# Altium project mecobo3.PrjPcb (part 1 of 2)
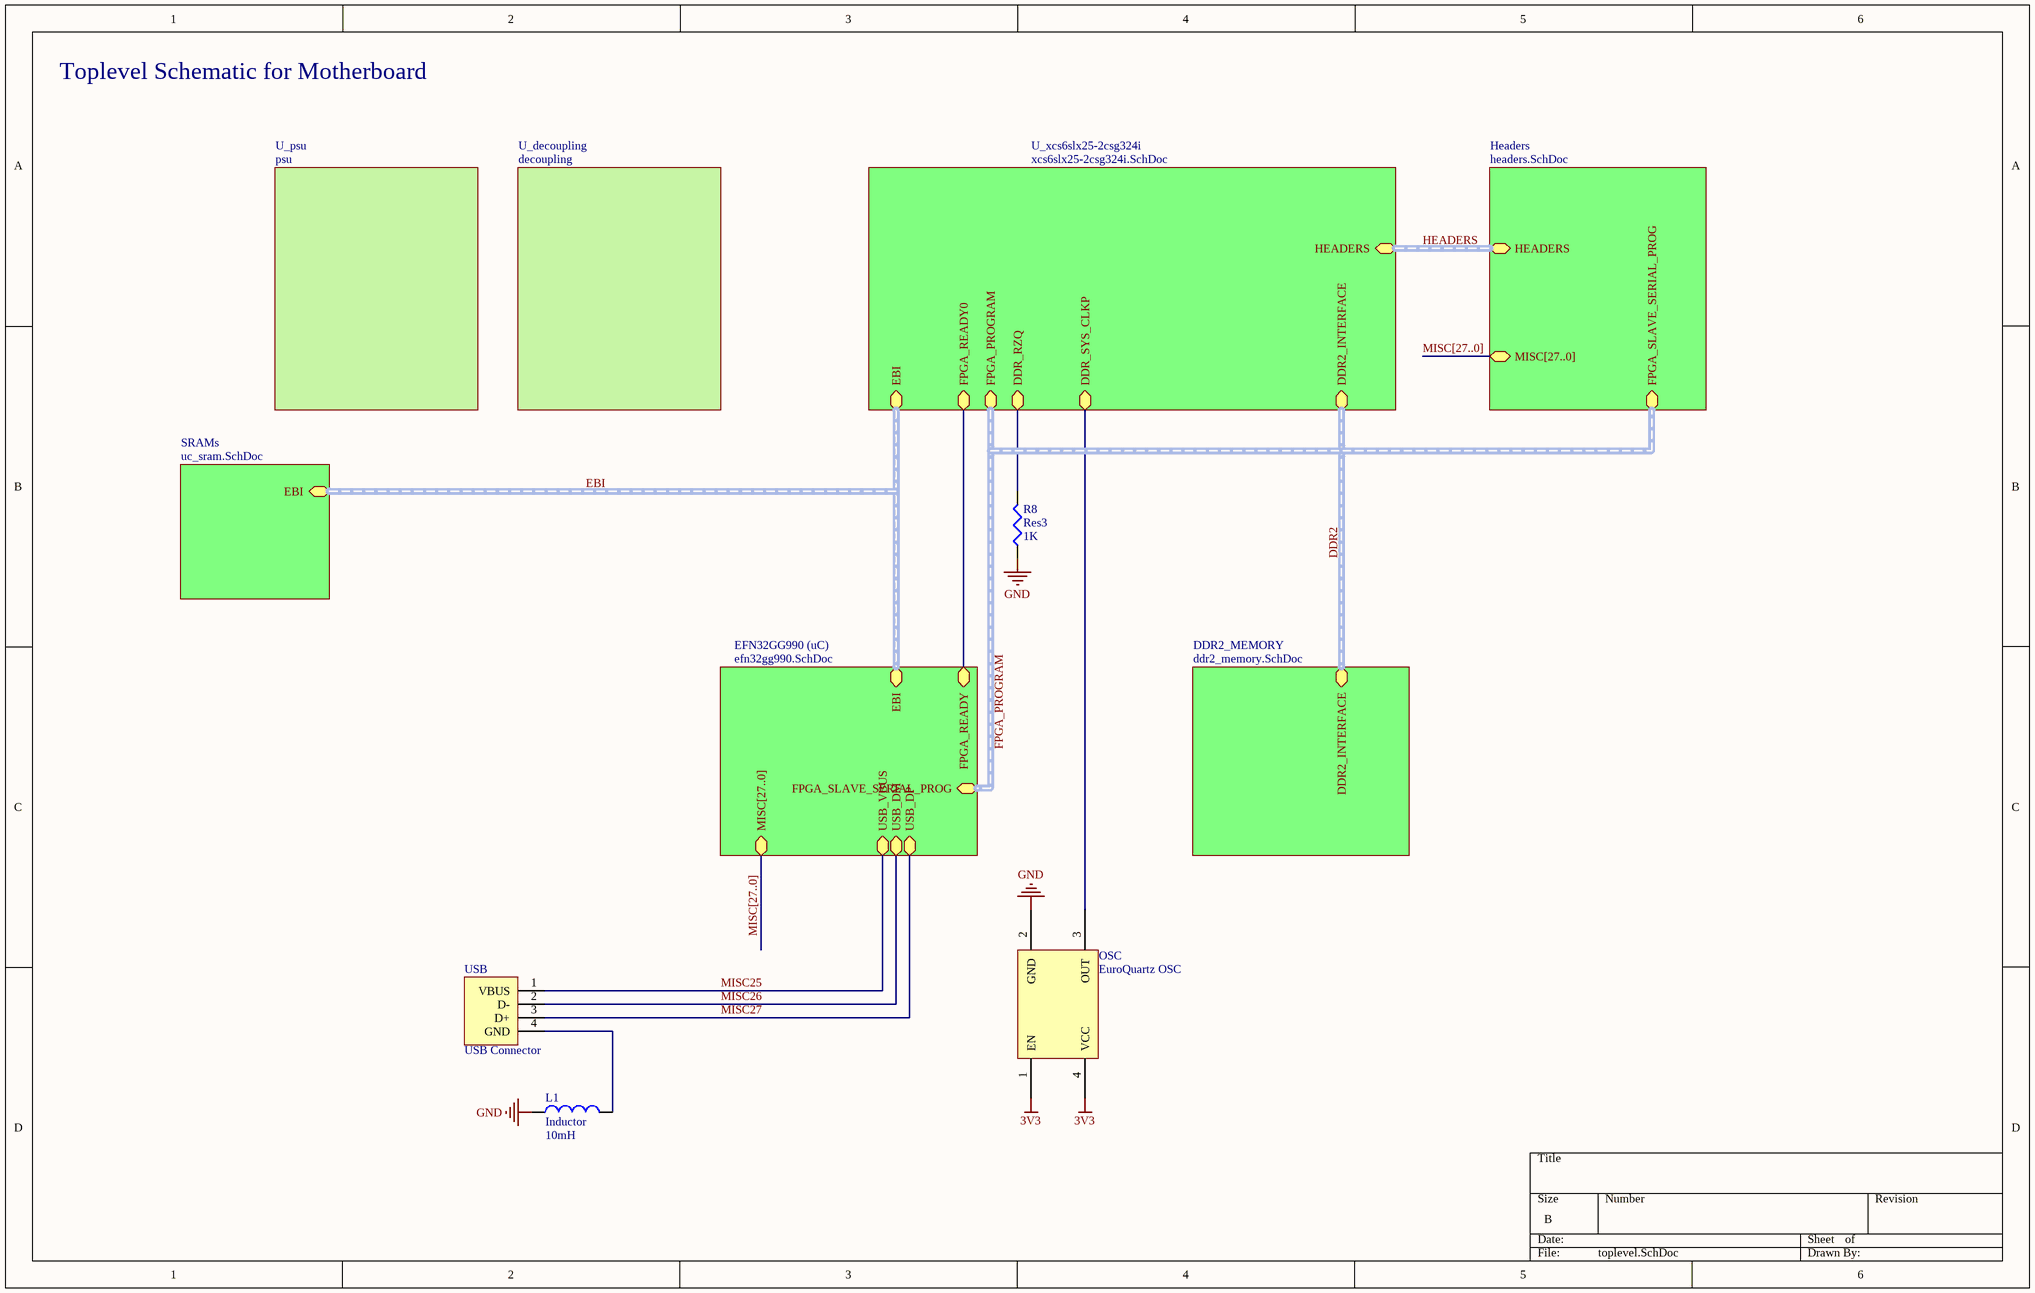
[diagram p0: toplevel.SchDoc]
10 sheets, 112 parts. Net scope: hierarchical (ports join the sheet entries above them; power ports are global).
Board file: board_2.PcbDoc
Sheets:
  toplevel.SchDoc
    EFN32GG990 (uC) = efn32gg990.SchDoc
    U_xcs6slx25-2csg324i = xcs6slx25-2csg324i.SchDoc
    U_psu = psu.SchDoc
      MAX8860EUA18 = 8860.SchDoc
      MAX8860EUA33 = 8860.SchDoc
      U_MIC5248 = MIC5248.SchDoc
    U_decoupling = decoupling.SchDoc
    DDR2_MEMORY = ddr2_memory.SchDoc
    Headers = headers.SchDoc
    SRAMs = uc_sram.SchDoc

## Sheet toplevel.SchDoc: Toplevel Schematic for Motherboard
size B

### Parts
L1  Inductor  value 10mH  [C1210]
OSC  EuroQuartz OSC  [SOP4]
R8  Res3  value 1K  [14-1210]
USB  USB Connector  [USB2.5-2H4D]

### Sub-sheets
DDR2_MEMORY = ddr2_memory.SchDoc: DDR2_INTERFACE (harness DDR2_INTERFACE)
EFN32GG990 (uC) = efn32gg990.SchDoc: USB_VBUS, USB_DP, USB_DM, FPGA_READY, FPGA_SLAVE_SERIAL_PROG (harness FPGA_SLAVE_SERIAL_PROG), EBI (harness EBI), MISC[27..0]
Headers = headers.SchDoc: HEADERS (harness HEADERS), MISC[27..0], FPGA_SLAVE_SERIAL_PROG (harness FPGA_SLAVE_SERIAL_PROG)
SRAMs = uc_sram.SchDoc: EBI (harness EBI)
U_decoupling = decoupling: no entries
U_psu = psu: no entries
U_xcs6slx25-2csg324i = xcs6slx25-2csg324i.SchDoc: FPGA_READY0, DDR_RZQ, DDR_SYS_CLKP, DDR2_INTERFACE (harness DDR2_INTERFACE), FPGA_PROGRAM (harness FPGA_SLAVE_SERIAL_PROG), EBI (harness EBI), HEADERS (harness HEADERS)

### Nets
3V3: OSC.1(EN) OSC.4(VCC)
GND: L1.1 OSC.2(GND) R8.1
DDR_RZQ: R8.2 ; sheet U_xcs6slx25-2csg324i/DDR_RZQ
FPGA_READY: sheet EFN32GG990 (uC)/FPGA_READY, sheet U_xcs6slx25-2csg324i/FPGA_READY0
MISC25: USB.1(VBUS) ; sheet EFN32GG990 (uC)/USB_VBUS
MISC26: USB.2(D-) ; sheet EFN32GG990 (uC)/USB_DM
MISC27: USB.3(D+) ; sheet EFN32GG990 (uC)/USB_DP
NetFPGA_R10: OSC.3(OUT) ; sheet U_xcs6slx25-2csg324i/DDR_SYS_CLKP
NetL1_2: L1.2 USB.4(GND)

### Buses and harness runs
bus MISC[27..0] = sheet EFN32GG990 (uC)/MISC[27..0]
bus MISC[27..0] = sheet Headers/MISC[27..0]
harness DDR2 = sheet DDR2_MEMORY/DDR2_INTERFACE = sheet U_xcs6slx25-2csg324i/DDR2_INTERFACE
harness EBI = sheet EFN32GG990 (uC)/EBI = sheet SRAMs/EBI = sheet U_xcs6slx25-2csg324i/EBI
harness FPGA_PROGRAM = sheet EFN32GG990 (uC)/FPGA_SLAVE_SERIAL_PROG = sheet Headers/FPGA_SLAVE_SERIAL_PROG = sheet U_xcs6slx25-2csg324i/FPGA_PROGRAM
harness HEADERS = sheet Headers/HEADERS = sheet U_xcs6slx25-2csg324i/HEADERS

### Notes on the sheet
- Toplevel Schematic for Motherboard

### Library data of the parts
L1 = Inductor: Code_IEC: 1005; Published: 8-Jun-2000; LatestRevisionDate: 29-May-2009; LatestRevisionNote: IPC-7351 Footprint Added.; PackageReference: 0402-A; Publisher: Altium Limited; PackageDescription: Chip Inductor; Code_JEITA: 0402
OSC = EuroQuartz OSC: XO53050UITA
R8 = Res3: Resistor; Published: 8-Jun-2000; LatestRevisionDate: 29-May-2009; LatestRevisionNote: IPC-7351 Footprint Added.; PackageReference: J1-0603; Publisher: Altium Limited; PackageDescription: Chip Resistor

## Sheet efn32gg990.SchDoc
size C
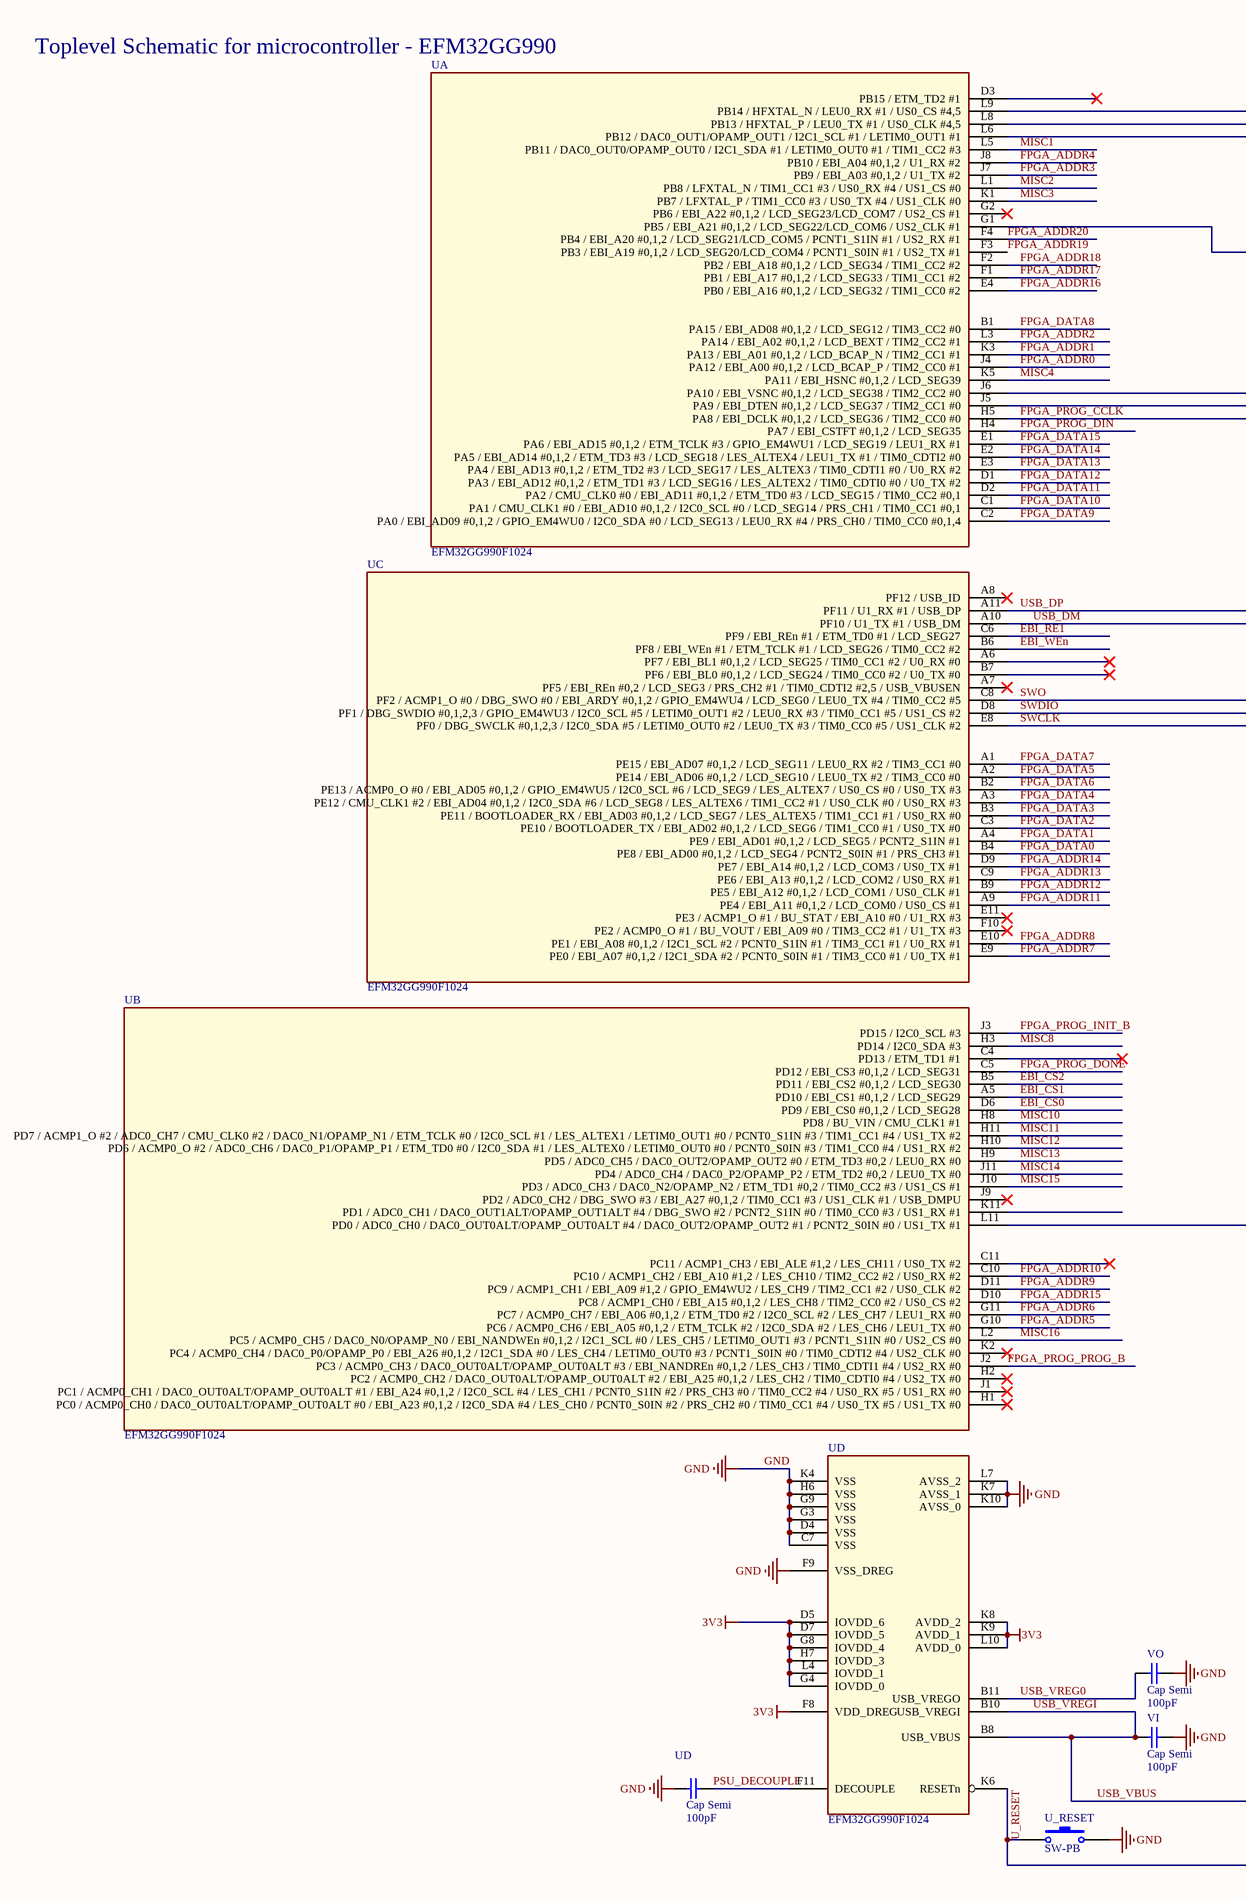
[diagram p1: efn32gg990.SchDoc, left]
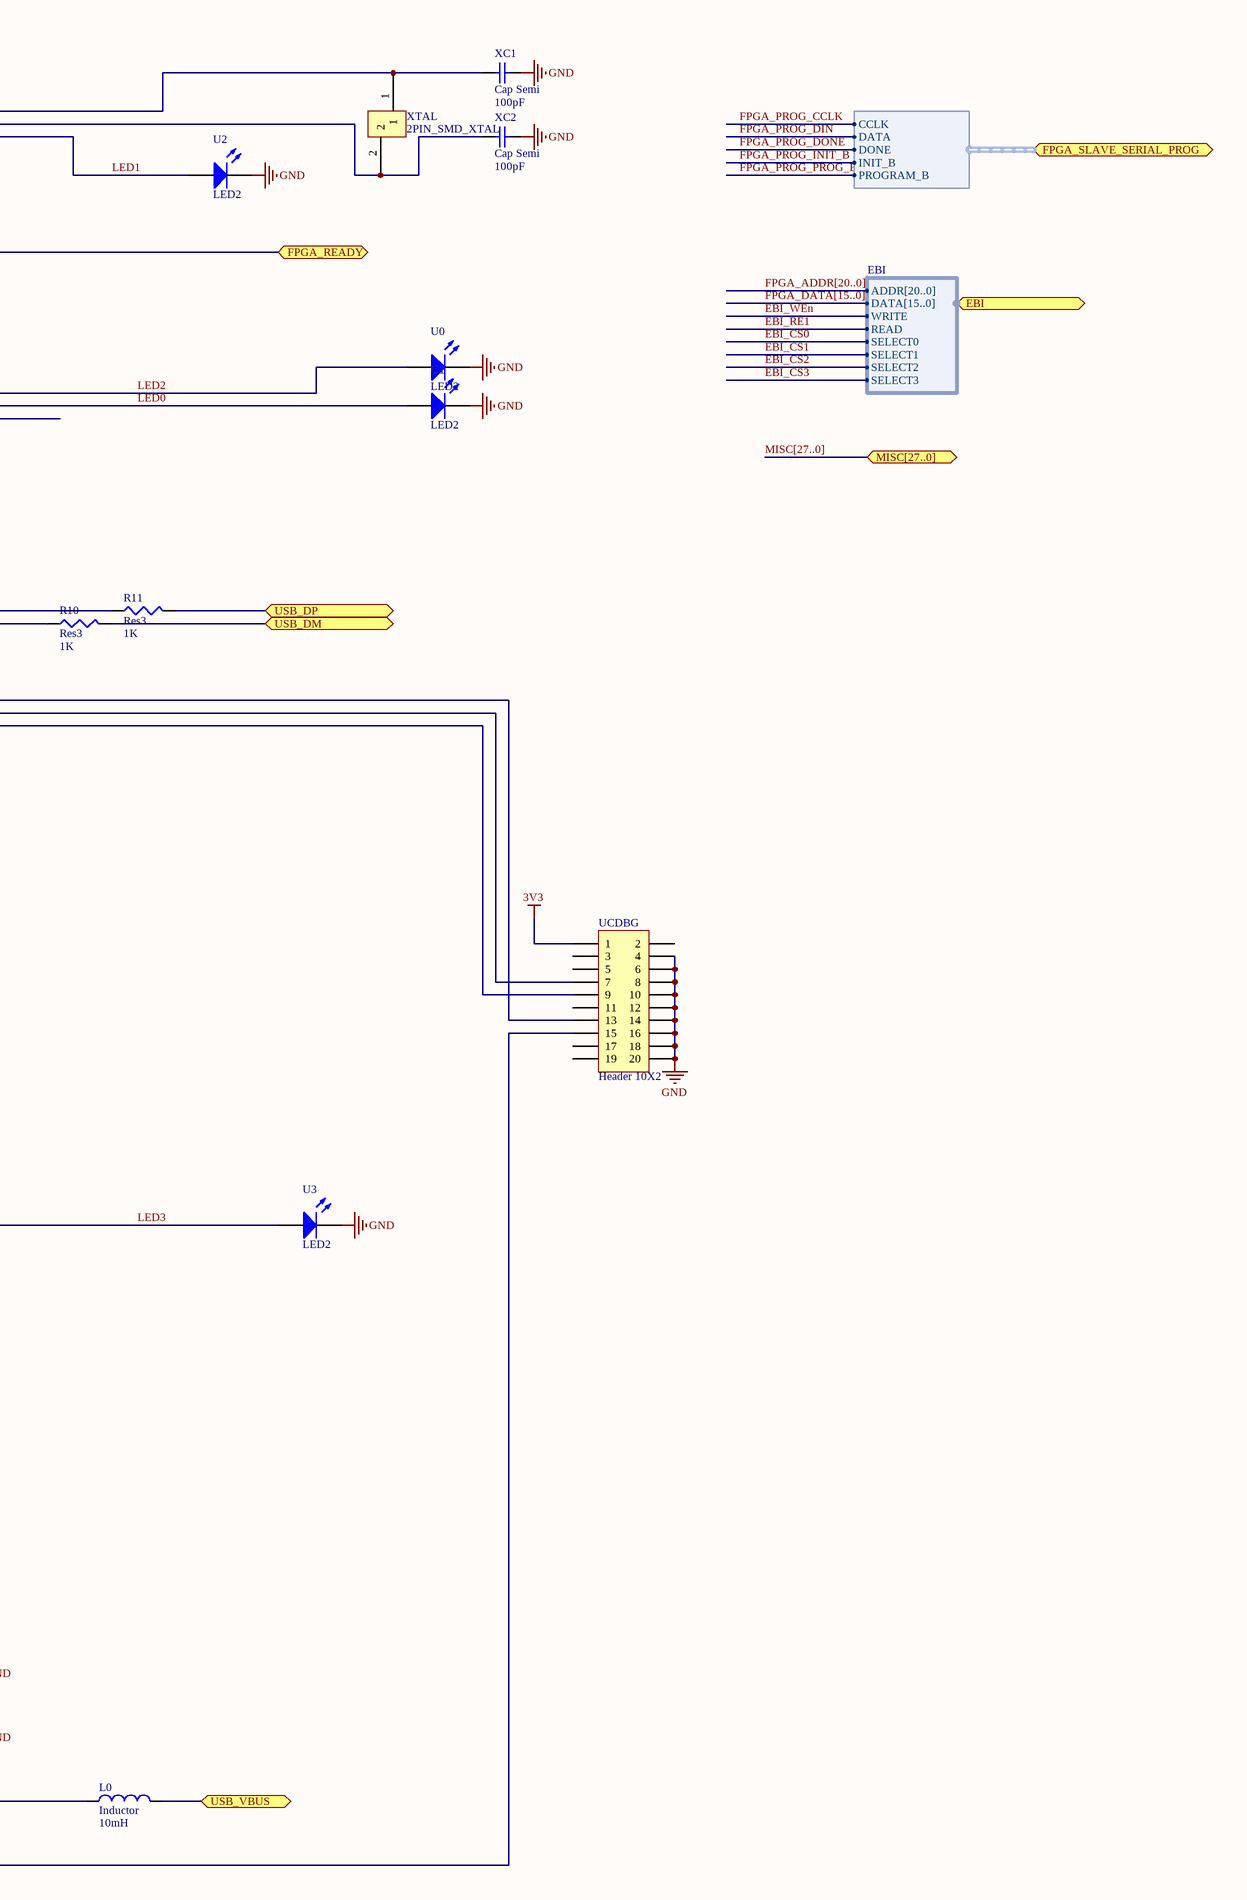
[diagram p2: efn32gg990.SchDoc, right]

### Parts
L0  Inductor  value 10mH  [C1210]
R10  Res3  value 1K  [14-1210]
R11  Res3  value 1K  [14-1210]
U  EFM32GG990F1024  [BGA112]  (parts A,B,C,D of 4)
U0  LED2  [3.2X1.6X1.1]
U1  LED2  [3.2X1.6X1.1]
U2  LED2  [3.2X1.6X1.1]
U3  LED2  [3.2X1.6X1.1]
U_RESET  SW-PB  [SPST-2]
UCDBG  Header 10X2  [HDR2X10]
UD  Cap Semi  value 100pF  [C1206]
VI  Cap Semi  value 100pF  [C1206]
VO  Cap Semi  value 100pF  [C1206]
XC1  Cap Semi  value 100pF  [C1206]
XC2  Cap Semi  value 100pF  [C1206]
XTAL  2PIN_SMD_XTAL  [48MHZ_XTAL_PAD]

### Ports
EBI (harness EBI), FPGA_READY, FPGA_SLAVE_SERIAL_PROG (harness FPGA_SLAVE_SERIAL_PROG), MISC[27..0], USB_DM, USB_DP, USB_VBUS

### Harnesses
FPGA_SLAVE_SERIAL_PROG: CCLK, DATA, DONE, INIT_B, PROGRAM_B
EBI: READ, WRITE, SELECT0, DATA[15..0], ADDR[20..0], SELECT1, SELECT2, SELECT3

### Nets
3V3: U.D5(IOVDD_6) U.D7(IOVDD_5) U.F8(VDD_DREG) U.G4(IOVDD_0) U.G8(IOVDD_4) U.H7(IOVDD_3) U.K8(AVDD_2) U.K9(AVDD_1) U.L4(IOVDD_1) U.L10(AVDD_0) UCDBG.1
GND: U.C7(VSS) U.D4(VSS) U.F9(VSS_DREG) U.G3(VSS) U.G9(VSS) U.H6(VSS) U.K4(VSS) U.K7(AVSS_1) U.K10(AVSS_0) U.L7(AVSS_2) U0.2(K) U1.2(K) U2.2(K) U3.2(K) U_RESET.2 UCDBG.4 UCDBG.6 UCDBG.8 UCDBG.10 UCDBG.12 UCDBG.14 UCDBG.16 UCDBG.18 UCDBG.20 UD.1 VI.2 VO.2 XC1.2 XC2.2
EBI_CS0: U.D6(PD9_/_EBI_CS0_#0,1,2_/_LCD_SEG28) ; port EBI.SELECT0  [project net EBI.SELECT0]
EBI_CS1: U.A5(PD10_/_EBI_CS1_#0,1,2_/_LCD_SEG29) ; port EBI.SELECT1  [project net EBI.SELECT1]
EBI_CS2: U.B5(PD11_/_EBI_CS2_#0,1,2_/_LCD_SEG30) ; port EBI.SELECT2  [project net EBI.SELECT2]
EBI_CS3: port EBI.SELECT3  [project net EBI.SELECT3]
EBI_RE1: U.C6(PF9_/_EBI_REn_#1_/_ETM_TD0_#1_/_LCD_SEG27) ; port EBI.READ  [project net EBI.READ]
EBI_WEn: U.B6(PF8_/_EBI_WEn_#1_/_ETM_TCLK_#1_/_LCD_SEG26_/_TIM0_CC2_#2) ; port EBI.WRITE  [project net EBI.WRITE]
FPGA_ADDR0: U.J4(PA12_/_EBI_A00_#0,1,2_/_LCD_BCAP_P_/_TIM2_CC0_#1)  [project net ADDR0]
FPGA_ADDR1: U.K3(PA13_/_EBI_A01_#0,1,2_/_LCD_BCAP_N_/_TIM2_CC1_#1)  [project net ADDR1]
FPGA_ADDR2: U.L3(PA14_/_EBI_A02_#0,1,2_/_LCD_BEXT_/_TIM2_CC2_#1)  [project net ADDR2]
FPGA_ADDR3: U.J7(PB9_/_EBI_A03_#0,1,2_/_U1_TX_#2)  [project net ADDR3]
FPGA_ADDR4: U.J8(PB10_/_EBI_A04_#0,1,2_/_U1_RX_#2)  [project net ADDR4]
FPGA_ADDR5: U.G10(PC6_/_ACMP0_CH6_/_EBI_A05_#0,1,2_/_ETM_TCLK_#2_/_I2C0_SDA_#2_/_LES_CH6_/_LEU1_TX_#0)  [project net ADDR5]
FPGA_ADDR6: U.G11(PC7_/_ACMP0_CH7_/_EBI_A06_#0,1,2_/_ETM_TD0_#2_/_I2C0_SCL_#2_/_LES_CH7_/_LEU1_RX_#0)  [project net ADDR6]
FPGA_ADDR7: U.E9(PE0_/_EBI_A07_#0,1,2_/_I2C1_SDA_#2_/_PCNT0_S0IN_#1_/_TIM3_CC0_#1_/_U0_TX_#1)  [project net ADDR7]
FPGA_ADDR8: U.E10(PE1_/_EBI_A08_#0,1,2_/_I2C1_SCL_#2_/_PCNT0_S1IN_#1_/_TIM3_CC1_#1_/_U0_RX_#1)  [project net ADDR8]
FPGA_ADDR9: U.D11(PC9_/_ACMP1_CH1_/_EBI_A09_#1,2_/_GPIO_EM4WU2_/_LES_CH9_/_TIM2_CC1_#2_/_US0_CLK_#2)  [project net ADDR9]
FPGA_ADDR10: U.C10(PC10_/_ACMP1_CH2_/_EBI_A10_#1,2_/_LES_CH10_/_TIM2_CC2_#2_/_US0_RX_#2)  [project net ADDR10]
FPGA_ADDR11: U.A9(PE4_/_EBI_A11_#0,1,2_/_LCD_COM0_/_US0_CS_#1)  [project net ADDR11]
FPGA_ADDR12: U.B9(PE5_/_EBI_A12_#0,1,2_/_LCD_COM1_/_US0_CLK_#1)  [project net ADDR12]
FPGA_ADDR13: U.C9(PE6_/_EBI_A13_#0,1,2_/_LCD_COM2_/_US0_RX_#1)  [project net ADDR13]
FPGA_ADDR14: U.D9(PE7_/_EBI_A14_#0,1,2_/_LCD_COM3_/_US0_TX_#1)  [project net ADDR14]
FPGA_ADDR15: U.D10(PC8_/_ACMP1_CH0_/_EBI_A15_#0,1,2_/_LES_CH8_/_TIM2_CC0_#2_/_US0_CS_#2)  [project net ADDR15]
FPGA_ADDR16: U.E4(PB0_/_EBI_A16_#0,1,2_/_LCD_SEG32_/_TIM1_CC0_#2)  [project net ADDR16]
FPGA_ADDR17: U.F1(PB1_/_EBI_A17_#0,1,2_/_LCD_SEG33_/_TIM1_CC1_#2)  [project net ADDR17]
FPGA_ADDR18: U.F2(PB2_/_EBI_A18_#0,1,2_/_LCD_SEG34_/_TIM1_CC2_#2)  [project net ADDR18]
FPGA_ADDR19: U.F3(PB3_/_EBI_A19_#0,1,2_/_LCD_SEG20/LCD_COM4_/_PCNT1_S0IN_#1_/_US2_TX_#1)  [project net ADDR19]
FPGA_ADDR20: U.F4(PB4_/_EBI_A20_#0,1,2_/_LCD_SEG21/LCD_COM5_/_PCNT1_S1IN_#1_/_US2_RX_#1)  [project net ADDR20]
FPGA_DATA0: U.B4(PE8_/_EBI_AD00_#0,1,2_/_LCD_SEG4_/_PCNT2_S0IN_#1_/_PRS_CH3_#1)  [project net DATA0]
FPGA_DATA1: U.A4(PE9_/_EBI_AD01_#0,1,2_/_LCD_SEG5_/_PCNT2_S1IN_#1)  [project net DATA1]
FPGA_DATA2: U.C3(PE10_/_BOOTLOADER_TX_/_EBI_AD02_#0,1,2_/_LCD_SEG6_/_TIM1_CC0_#1_/_US0_TX_#0)  [project net DATA2]
FPGA_DATA3: U.B3(PE11_/_BOOTLOADER_RX_/_EBI_AD03_#0,1,2_/_LCD_SEG7_/_LES_ALTEX5_/_TIM1_CC1_#1_/_US0_RX_#0)  [project net DATA3]
FPGA_DATA4: U.A3(PE12_/_CMU_CLK1_#2_/_EBI_AD04_#0,1,2_/_I2C0_SDA_#6_/_LCD_SEG8_/_LES_ALTEX6_/_TIM1_CC2_#1_/_US0_CLK_#0_/_US0_RX_#3)  [project net DATA4]
FPGA_DATA5: U.A2(PE14_/_EBI_AD06_#0,1,2_/_LCD_SEG10_/_LEU0_TX_#2_/_TIM3_CC0_#0)  [project net DATA5]
FPGA_DATA6: U.B2(PE13_/_ACMP0_O_#0_/_EBI_AD05_#0,1,2_/_GPIO_EM4WU5_/_I2C0_SCL_#6_/_LCD_SEG9_/_LES_ALTEX7_/_US0_CS_#0_/_US0_TX_#3)  [project net DATA6]
FPGA_DATA7: U.A1(PE15_/_EBI_AD07_#0,1,2_/_LCD_SEG11_/_LEU0_RX_#2_/_TIM3_CC1_#0)  [project net DATA7]
FPGA_DATA8: U.B1(PA15_/_EBI_AD08_#0,1,2_/_LCD_SEG12_/_TIM3_CC2_#0)  [project net DATA8]
FPGA_DATA9: U.C2(PA0_/_EBI_AD09_#0,1,2_/_GPIO_EM4WU0_/_I2C0_SDA_#0_/_LCD_SEG13_/_LEU0_RX_#4_/_PRS_CH0_/_TIM0_CC0_#0,1,4)  [project net DATA9]
FPGA_DATA10: U.C1(PA1_/_CMU_CLK1_#0_/_EBI_AD10_#0,1,2_/_I2C0_SCL_#0_/_LCD_SEG14_/_PRS_CH1_/_TIM0_CC1_#0,1)  [project net DATA10]
FPGA_DATA11: U.D2(PA2_/_CMU_CLK0_#0_/_EBI_AD11_#0,1,2_/_ETM_TD0_#3_/_LCD_SEG15_/_TIM0_CC2_#0,1)  [project net DATA11]
FPGA_DATA12: U.D1(PA3_/_EBI_AD12_#0,1,2_/_ETM_TD1_#3_/_LCD_SEG16_/_LES_ALTEX2_/_TIM0_CDTI0_#0_/_U0_TX_#2)  [project net DATA12]
FPGA_DATA13: U.E3(PA4_/_EBI_AD13_#0,1,2_/_ETM_TD2_#3_/_LCD_SEG17_/_LES_ALTEX3_/_TIM0_CDTI1_#0_/_U0_RX_#2)  [project net DATA13]
FPGA_DATA14: U.E2(PA5_/_EBI_AD14_#0,1,2_/_ETM_TD3_#3_/_LCD_SEG18_/_LES_ALTEX4_/_LEU1_TX_#1_/_TIM0_CDTI2_#0)  [project net DATA14]
FPGA_DATA15: U.E1(PA6_/_EBI_AD15_#0,1,2_/_ETM_TCLK_#3_/_GPIO_EM4WU1_/_LCD_SEG19_/_LEU1_RX_#1)  [project net DATA15]
FPGA_PROG_CCLK: U.H5(PA8_/_EBI_DCLK_#0,1,2_/_LCD_SEG36_/_TIM2_CC0_#0) ; port FPGA_SLAVE_SERIAL_PROG.CCLK  [project net FPGA_CCLK]
FPGA_PROG_DIN: U.H4(PA7_/_EBI_CSTFT_#0,1,2_/_LCD_SEG35) ; port FPGA_SLAVE_SERIAL_PROG.DATA  [project net FPGA_DIN]
FPGA_PROG_DONE: U.C5(PD12_/_EBI_CS3_#0,1,2_/_LCD_SEG31) ; port FPGA_SLAVE_SERIAL_PROG.DONE  [project net FPGA_DONE]
FPGA_PROG_INIT_B: U.J3(PD15_/_I2C0_SCL_#3) ; port FPGA_SLAVE_SERIAL_PROG.INIT_B  [project net FPGA_INIT_B]
FPGA_PROG_PROG_B: U.J2(PC3_/_ACMP0_CH3_/_DAC0_OUT0ALT/OPAMP_OUT0ALT_#3_/_EBI_NANDREn_#0,1,2_/_LES_CH3_/_TIM0_CDTI1_#4_/_US2_RX_#0) ; port FPGA_SLAVE_SERIAL_PROG.PROGRAM_B  [project net FPGA_PROG_B]
FPGA_READY: U.G1(PB5_/_EBI_A21_#0,1,2_/_LCD_SEG22/LCD_COM6_/_US2_CLK_#1) ; port FPGA_READY
LED0: U.J5(PA9_/_EBI_DTEN_#0,1,2_/_LCD_SEG37_/_TIM2_CC1_#0) U1.1(A)
LED1: U.L6(PB12_/_DAC0_OUT1/OPAMP_OUT1_/_I2C1_SCL_#1_/_LETIM0_OUT1_#1) U2.1(A)
LED2: U.J6(PA10_/_EBI_VSNC_#0,1,2_/_LCD_SEG38_/_TIM2_CC2_#0) U0.1(A)
LED3: U.L11(PD0_/_ADC0_CH0_/_DAC0_OUT0ALT/OPAMP_OUT0ALT_#4_/_DAC0_OUT2/OPAMP_OUT2_#1_/_PCNT2_S0IN_#0_/_US1_TX_#1) U3.1(A)
MISC1: U.L5(PB11_/_DAC0_OUT0/OPAMP_OUT0_/_I2C1_SDA_#1_/_LETIM0_OUT0_#1_/_TIM1_CC2_#3)
MISC2: U.L1(PB8_/_LFXTAL_N_/_TIM1_CC1_#3_/_US0_RX_#4_/_US1_CS_#0)
MISC3: U.K1(PB7_/_LFXTAL_P_/_TIM1_CC0_#3_/_US0_TX_#4_/_US1_CLK_#0)
MISC4: U.K5(PA11_/_EBI_HSNC_#0,1,2_/_LCD_SEG39)
MISC8: U.H3(PD14_/_I2C0_SDA_#3)
MISC10: U.H8(PD8_/_BU_VIN_/_CMU_CLK1_#1)
MISC11: U.H11(PD7_/_ACMP1_O_#2_/_ADC0_CH7_/_CMU_CLK0_#2_/_DAC0_N1/OPAMP_N1_/_ETM_TCLK_#0_/_I2C0_SCL_#1_/_LES_ALTEX1_/_LETIM0_OUT1_#0_/_PCNT0_S1IN_#3_/_TIM1_CC1_#4_/_US1_TX_#2)
MISC12: U.H10(PD6_/_ACMP0_O_#2_/_ADC0_CH6_/_DAC0_P1/OPAMP_P1_/_ETM_TD0_#0_/_I2C0_SDA_#1_/_LES_ALTEX0_/_LETIM0_OUT0_#0_/_PCNT0_S0IN_#3_/_TIM1_CC0_#4_/_US1_RX_#2)
MISC13: U.H9(PD5_/_ADC0_CH5_/_DAC0_OUT2/OPAMP_OUT2_#0_/_ETM_TD3_#0,2_/_LEU0_RX_#0)
MISC14: U.J11(PD4_/_ADC0_CH4_/_DAC0_P2/OPAMP_P2_/_ETM_TD2_#0,2_/_LEU0_TX_#0)
MISC15: U.J10(PD3_/_ADC0_CH3_/_DAC0_N2/OPAMP_N2_/_ETM_TD1_#0,2_/_TIM0_CC2_#3_/_US1_CS_#1)
MISC16: U.L2(PC5_/_ACMP0_CH5_/_DAC0_N0/OPAMP_N0_/_EBI_NANDWEn_#0,1,2_/_I2C1_SCL_#0_/_LES_CH5_/_LETIM0_OUT1_#3_/_PCNT1_S1IN_#0_/_US2_CS_#0)
MISC25: L0.2 ; port USB_VBUS
MISC26: R10.2 ; port USB_DM
MISC27: R11.2 ; port USB_DP
PSU_DECOUPLE: U.F11(DECOUPLE) UD.2
SWCLK: U.E8(PF0_/_DBG_SWCLK_#0,1,2,3_/_I2C0_SDA_#5_/_LETIM0_OUT0_#2_/_LEU0_TX_#3_/_TIM0_CC0_#5_/_US1_CLK_#2) UCDBG.9
SWDIO: U.D8(PF1_/_DBG_SWDIO_#0,1,2,3_/_GPIO_EM4WU3_/_I2C0_SCL_#5_/_LETIM0_OUT1_#2_/_LEU0_RX_#3_/_TIM0_CC1_#5_/_US1_CS_#2) UCDBG.7
SWO: U.C8(PF2_/_ACMP1_O_#0_/_DBG_SWO_#0_/_EBI_ARDY_#0,1,2_/_GPIO_EM4WU4_/_LCD_SEG0_/_LEU0_TX_#4_/_TIM0_CC2_#5) UCDBG.13
U_RESET: U.K6(RESETn) U_RESET.1 UCDBG.15
USB_DM: R10.1 U.A10(PF10_/_U1_TX_#1_/_USB_DM)
USB_DP: R11.1 U.A11(PF11_/_U1_RX_#1_/_USB_DP)
USB_VBUS: L0.1 U.B8(USB_VBUS) U.B10(USB_VREGI) VI.1  [also labelled USB_VREGI]
USB_VREG0: U.B11(USB_VREGO) VO.1
NetU_L8: U.L8(PB13_/_HFXTAL_P_/_LEU0_TX_#1_/_US0_CLK_#4,5) XC2.1 XTAL.2
NetU_L9: U.L9(PB14_/_HFXTAL_N_/_LEU0_RX_#1_/_US0_CS_#4,5) XC1.1 XTAL.1

Not connected (* = marked no-connect by the designer): U A6(PF7_/_EBI_BL1_#0,1,2_/_LCD_SEG25_/_TIM0_CC1_#2_/_U0_RX_#0)* A7(PF5_/_EBI_REn_#0,2_/_LCD_SEG3_/_PRS_CH2_#1_/_TIM0_CDTI2_#2,5_/_USB_VBUSEN)* A8(PF12_/_USB_ID)* B7(PF6_/_EBI_BL0_#0,1,2_/_LCD_SEG24_/_TIM0_CC0_#2_/_U0_TX_#0)* C4(PD13_/_ETM_TD1_#1)* C11(PC11_/_ACMP1_CH3_/_EBI_ALE_#1,2_/_LES_CH11_/_US0_TX_#2)* D3(PB15_/_ETM_TD2_#1)* E11(PE3_/_ACMP1_O_#1_/_BU_STAT_/_EBI_A10_#0_/_U1_RX_#3)* F10(PE2_/_ACMP0_O_#1_/_BU_VOUT_/_EBI_A09_#0_/_TIM3_CC2_#1_/_U1_TX_#3)* G2(PB6_/_EBI_A22_#0,1,2_/_LCD_SEG23/LCD_COM7_/_US2_CS_#1)* H1(PC0_/_ACMP0_CH0_/_DAC0_OUT0ALT/OPAMP_OUT0ALT_#0_/_EBI_A23_#0,1,2_/_I2C0_SDA_#4_/_LES_CH0_/_PCNT0_S0IN_#2_/_PRS_CH2_#0_/_TIM0_CC1_#4_/_US0_TX_#5_/_US1_TX_#0)* H2(PC2_/_ACMP0_CH2_/_DAC0_OUT0ALT/OPAMP_OUT0ALT_#2_/_EBI_A25_#0,1,2_/_LES_CH2_/_TIM0_CDTI0_#4_/_US2_TX_#0)* J1(PC1_/_ACMP0_CH1_/_DAC0_OUT0ALT/OPAMP_OUT0ALT_#1_/_EBI_A24_#0,1,2_/_I2C0_SCL_#4_/_LES_CH1_/_PCNT0_S1IN_#2_/_PRS_CH3_#0_/_TIM0_CC2_#4_/_US0_RX_#5_/_US1_RX_#0)* J9(PD2_/_ADC0_CH2_/_DBG_SWO_#3_/_EBI_A27_#0,1,2_/_TIM0_CC1_#3_/_US1_CLK_#1_/_USB_DMPU)* K2(PC4_/_ACMP0_CH4_/_DAC0_P0/OPAMP_P0_/_EBI_A26_#0,1,2_/_I2C1_SDA_#0_/_LES_CH4_/_LETIM0_OUT0_#3_/_PCNT1_S0IN_#0_/_TIM0_CDTI2_#4_/_US2_CLK_#0)* K11(PD1_/_ADC0_CH1_/_DAC0_OUT1ALT/OPAMP_OUT1ALT_#4_/_DBG_SWO_#2_/_PCNT2_S1IN_#0_/_TIM0_CC0_#3_/_US1_RX_#1); UCDBG 2 3 5 11 17 19

### Buses and harness runs
bus FPGA_ADDR[20..0]
bus FPGA_DATA[15..0]
bus MISC[27..0] = port MISC[27..0]

### Notes on the sheet
- Toplevel Schematic for microcontroller - EFM32GG990

### Library data of the parts
L0 = Inductor: Code_IEC: 1005; Published: 8-Jun-2000; LatestRevisionDate: 29-May-2009; LatestRevisionNote: IPC-7351 Footprint Added.; PackageReference: 0402-A; Publisher: Altium Limited; PackageDescription: Chip Inductor; Code_JEITA: 0402
R10 R11 = Res3: Resistor; Published: 8-Jun-2000; LatestRevisionDate: 29-May-2009; LatestRevisionNote: IPC-7351 Footprint Added.; PackageReference: J1-0603; Publisher: Altium Limited; PackageDescription: Chip Resistor
U0-U3 = LED2: Typical RED, GREEN, YELLOW, AMBER GaAs LED; Published: 8-Jun-2000; LatestRevisionDate: 17-Jul-2002; LatestRevisionNote: Re-released for DXP Platform.; PackageVersion: Feb-2002; PackageReference: 3.2X1.6X1.1; Publisher: Altium Limited; PackageDescription: SM LED; 2 Flat Leads
U_RESET = SW-PB: Switch; Published: 24-Mar-1999; LatestRevisionDate: 17-Jul-2002; LatestRevisionNote: Re-released for DXP Platform.; PackageReference: SPST-2; Publisher: Altium Limited; PackageDescription: Switch; 2 Leads
UCDBG = Header 10X2: Header, 10-Pin, Dual row; LatestRevisionDate: 17-Jul-2002; LatestRevisionNote: Re-released for DXP Platform.; Publisher: Altium Limited
UD VI VO XC1 XC2 = Cap Semi: Capacitor (Semiconductor SIM Model); Published: 8-Jun-2000; LatestRevisionDate: 29-May-2009; LatestRevisionNote: IPC-7351 Footprint Added.; PackageReference: C1206; Publisher: Altium Limited; PackageDescription: Chip Capacitor

## Sheet xcs6slx25-2csg324i.SchDoc
size D
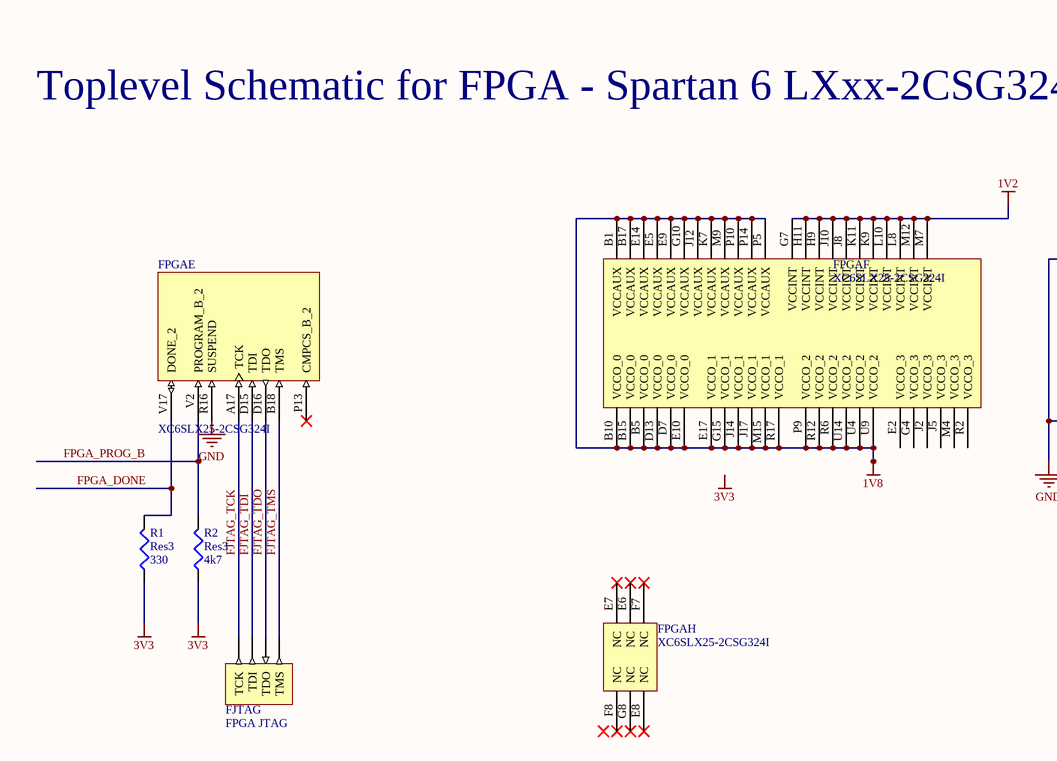
[diagram p3: xcs6slx25-2csg324i.SchDoc, top left]
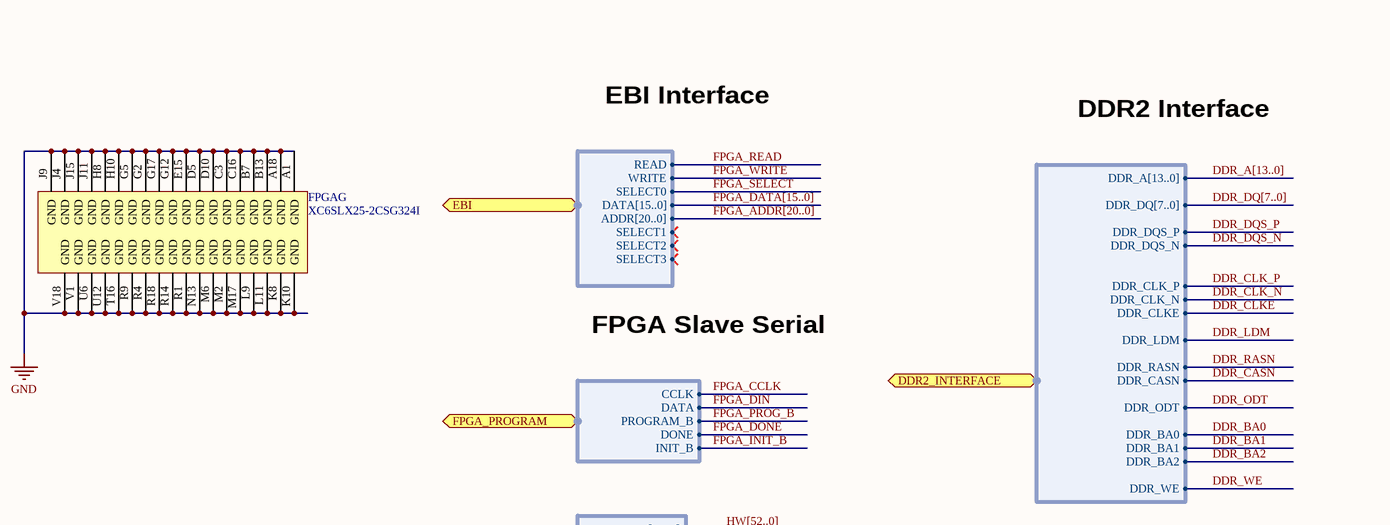
[diagram p4: xcs6slx25-2csg324i.SchDoc, top right]
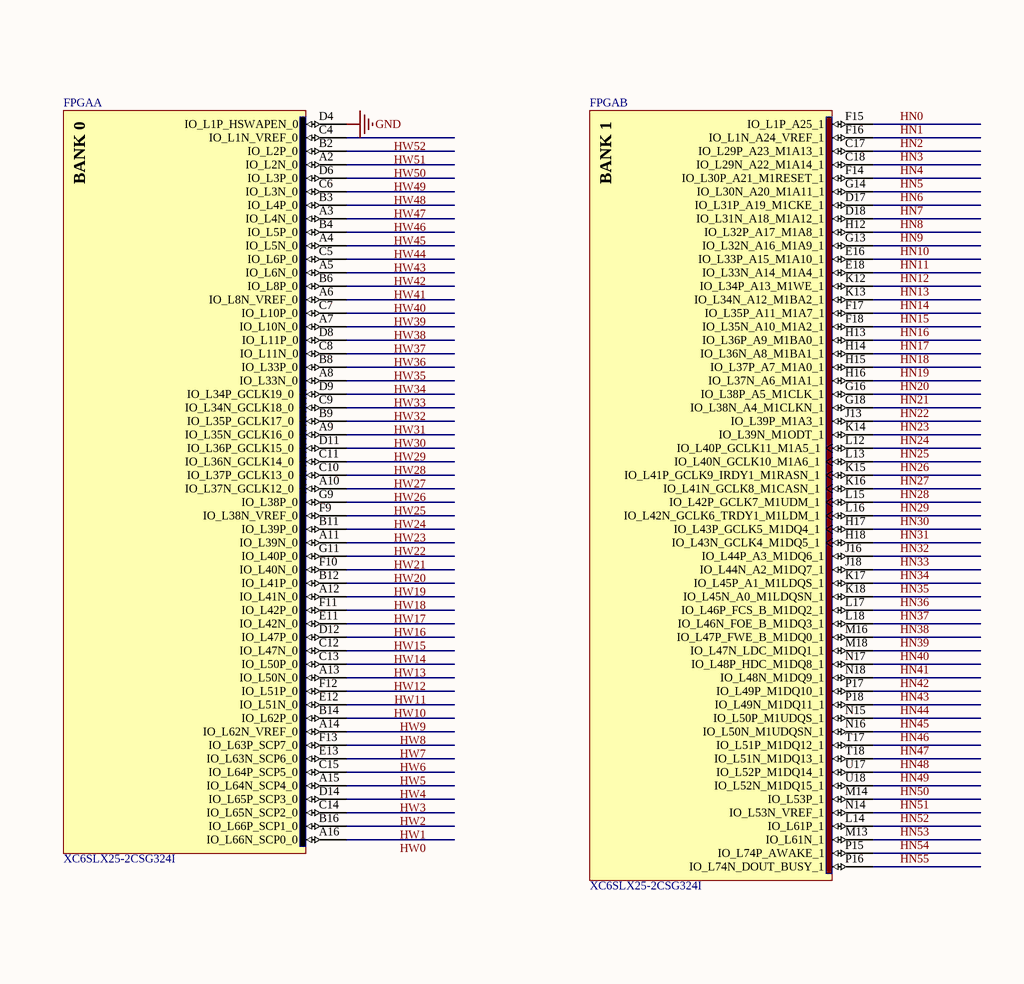
[diagram p5: xcs6slx25-2csg324i.SchDoc, bottom left]
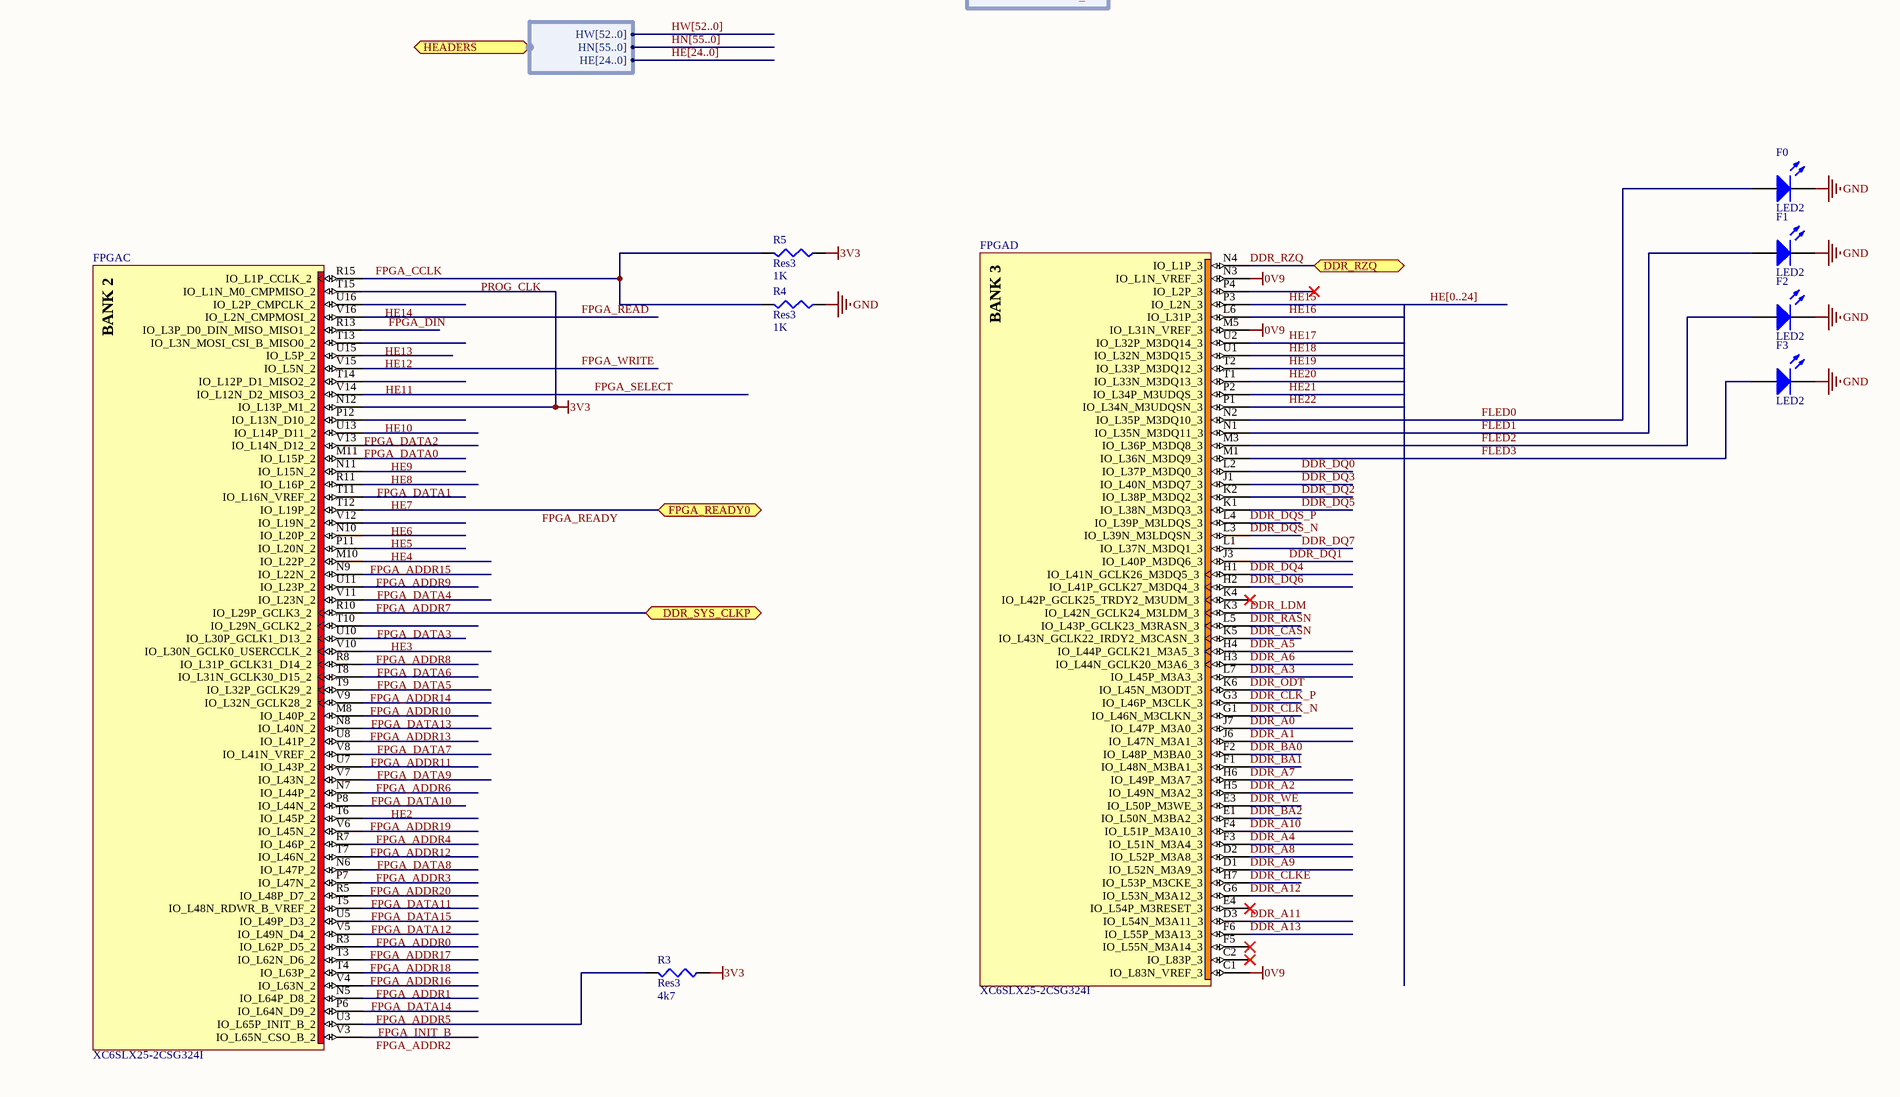
[diagram p6: xcs6slx25-2csg324i.SchDoc, bottom right]

### Parts
(Parts that share a designator on the sheet are numbered #1, #2 ... from top to bottom, then left to right.)
F0  LED2  [3.2X1.6X1.1]
F1  LED2  [3.2X1.6X1.1]
F2  LED2  [3.2X1.6X1.1]
F3  LED2  [3.2X1.6X1.1]
FJTAG  FPGA JTAG  [HDR1X4]
FPGA  XC6SLX25-2CSG324I  [CSG324]  (parts A,B,C,D,E,F,G,H of 8)
R1#1  Res3  value 330  [14-1210]
R2#1  Res3  value 4k7  [14-1210]
R3  Res3  value 4k7  [14-1210]
R4  Res3  value 1K  [14-1210]
R5  Res3  value 1K  [14-1210]

### Ports
DDR2_INTERFACE (harness DDR2_INTERFACE), DDR_RZQ, DDR_SYS_CLKP, EBI (harness EBI), FPGA_PROGRAM (harness FPGA_SLAVE_SERIAL_PROG), FPGA_READY0, HEADERS (harness HEADERS)

### Harnesses
DDR2_INTERFACE: DDR_A[13..0], DDR_DQ[7..0], DDR_DQS_P, DDR_DQS_N, DDR_CLK_P, DDR_CLK_N, DDR_LDM, DDR_RASN, DDR_CASN, DDR_ODT, DDR_BA0, DDR_BA1, DDR_BA2, DDR_WE, DDR_CLKE
FPGA_SLAVE_SERIAL_PROG: CCLK, DATA, PROGRAM_B, DONE, INIT_B
EBI: READ, WRITE, SELECT0, DATA[15..0], ADDR[20..0], SELECT1, SELECT2, SELECT3
HEADERS: HW[52..0], HN[55..0], HE[24..0]

### Nets
0V9: FPGA.C1(IO_L83N_VREF_3) FPGA.M5(IO_L31N_VREF_3) FPGA.N3(IO_L1N_VREF_3)
1V2: FPGA.G7(VCCINT) FPGA.H9(VCCINT) FPGA.H11(VCCINT) FPGA.J8(VCCINT) FPGA.J10(VCCINT) FPGA.K9(VCCINT) FPGA.K11(VCCINT) FPGA.L8(VCCINT) FPGA.L10(VCCINT) FPGA.M7(VCCINT) FPGA.M12(VCCINT)
1V8: FPGA.B1(VCCAUX) FPGA.B5(VCCO_0) FPGA.B10(VCCO_0) FPGA.B15(VCCO_0) FPGA.B17(VCCAUX) FPGA.D7(VCCO_0) FPGA.D13(VCCO_0) FPGA.E5(VCCAUX) FPGA.E9(VCCAUX) FPGA.E10(VCCO_0) FPGA.E14(VCCAUX) FPGA.E17(VCCO_1) FPGA.G10(VCCAUX) FPGA.G15(VCCO_1) FPGA.J12(VCCAUX) FPGA.J14(VCCO_1) FPGA.J17(VCCO_1) FPGA.K7(VCCAUX) FPGA.M9(VCCAUX) FPGA.M15(VCCO_1) FPGA.P5(VCCAUX) FPGA.P9(VCCO_2) FPGA.P10(VCCAUX) FPGA.P14(VCCAUX) FPGA.R6(VCCO_2) FPGA.R12(VCCO_2) FPGA.R17(VCCO_1) FPGA.U4(VCCO_2) FPGA.U9(VCCO_2) FPGA.U14(VCCO_2)
3V3: FPGA.N12(IO_L13P_M1_2) FPGA.T15(IO_L1N_M0_CMPMISO_2) R1#1.1 R2#1.1 R3.1 R5.1
GND: F0.2(K) F1.2(K) F2.2(K) F3.2(K) FPGA.A1(GND) FPGA.A18(GND) FPGA.B7(GND) FPGA.B13(GND) FPGA.C3(GND) FPGA.C16(GND) FPGA.D4(IO_L1P_HSWAPEN_0) FPGA.D5(GND) FPGA.D10(GND) FPGA.E15(GND) FPGA.G2(GND) FPGA.G5(GND) FPGA.G12(GND) FPGA.G17(GND) FPGA.H8(GND) FPGA.H10(GND) FPGA.J4(GND) FPGA.J9(GND) FPGA.J11(GND) FPGA.J15(GND) FPGA.K8(GND) FPGA.K10(GND) FPGA.L9(GND) FPGA.L11(GND) FPGA.M2(GND) FPGA.M6(GND) FPGA.M17(GND) FPGA.N13(GND) FPGA.R1(GND) FPGA.R4(GND) FPGA.R9(GND) FPGA.R14(GND) FPGA.R16(SUSPEND) FPGA.R18(GND) FPGA.T16(GND) FPGA.U6(GND) FPGA.U12(GND) FPGA.V1(GND) FPGA.V18(GND) R4.1
DDR_A0: FPGA.J7(IO_L47P_M3A0_3)
DDR_A1: FPGA.J6(IO_L47N_M3A1_3)
DDR_A2: FPGA.H5(IO_L49N_M3A2_3)
DDR_A3: FPGA.L7(IO_L45P_M3A3_3)
DDR_A4: FPGA.F3(IO_L51N_M3A4_3)
DDR_A5: FPGA.H4(IO_L44P_GCLK21_M3A5_3)
DDR_A6: FPGA.H3(IO_L44N_GCLK20_M3A6_3)
DDR_A7: FPGA.H6(IO_L49P_M3A7_3)
DDR_A8: FPGA.D2(IO_L52P_M3A8_3)
DDR_A9: FPGA.D1(IO_L52N_M3A9_3)
DDR_A10: FPGA.F4(IO_L51P_M3A10_3)
DDR_A11: FPGA.D3(IO_L54N_M3A11_3)
DDR_A12: FPGA.G6(IO_L53N_M3A12_3)
DDR_A13: FPGA.F6(IO_L55P_M3A13_3)
DDR_BA0: FPGA.F2(IO_L48P_M3BA0_3) ; port DDR2_INTERFACE.DDR_BA0  [project net DDR2.DDR_BA0]
DDR_BA1: FPGA.F1(IO_L48N_M3BA1_3) ; port DDR2_INTERFACE.DDR_BA1  [project net DDR2.DDR_BA1]
DDR_BA2: FPGA.E1(IO_L50N_M3BA2_3) ; port DDR2_INTERFACE.DDR_BA2  [project net DDR2.DDR_BA2]
DDR_CASN: FPGA.K5(IO_L43N_GCLK22_IRDY2_M3CASN_3) ; port DDR2_INTERFACE.DDR_CASN  [project net DDR2.DDR_CASN]
DDR_CLK_N: FPGA.G1(IO_L46N_M3CLKN_3) ; port DDR2_INTERFACE.DDR_CLK_N  [project net DDR2.DDR_CLK_N]
DDR_CLK_P: FPGA.G3(IO_L46P_M3CLK_3) ; port DDR2_INTERFACE.DDR_CLK_P  [project net DDR2.DDR_CLK_P]
DDR_CLKE: FPGA.H7(IO_L53P_M3CKE_3) ; port DDR2_INTERFACE.DDR_CLKE  [project net DDR2.DDR_CLKE]
DDR_DQ0: FPGA.L2(IO_L37P_M3DQ0_3)
DDR_DQ1: FPGA.J3(IO_L40P_M3DQ6_3)
DDR_DQ2: FPGA.K2(IO_L38P_M3DQ2_3)
DDR_DQ3: FPGA.J1(IO_L40N_M3DQ7_3)
DDR_DQ4: FPGA.H1(IO_L41N_GCLK26_M3DQ5_3)
DDR_DQ5: FPGA.K1(IO_L38N_M3DQ3_3)
DDR_DQ6: FPGA.H2(IO_L41P_GCLK27_M3DQ4_3)
DDR_DQ7: FPGA.L1(IO_L37N_M3DQ1_3)
DDR_DQS_N: FPGA.L3(IO_L39N_M3LDQSN_3) ; port DDR2_INTERFACE.DDR_DQS_N  [project net DDR2.DDR_DQS_N]
DDR_DQS_P: FPGA.L4(IO_L39P_M3LDQS_3) ; port DDR2_INTERFACE.DDR_DQS_P  [project net DDR2.DDR_DQS_P]
DDR_LDM: FPGA.K3(IO_L42N_GCLK24_M3LDM_3) ; port DDR2_INTERFACE.DDR_LDM  [project net DDR2.DDR_LDM]
DDR_ODT: FPGA.K6(IO_L45N_M3ODT_3) ; port DDR2_INTERFACE.DDR_ODT  [project net DDR2.DDR_ODT]
DDR_RASN: FPGA.L5(IO_L43P_GCLK23_M3RASN_3) ; port DDR2_INTERFACE.DDR_RASN  [project net DDR2.DDR_RASN]
DDR_RZQ: FPGA.N4(IO_L1P_3) ; port DDR_RZQ
DDR_WE: FPGA.E3(IO_L50P_M3WE_3) ; port DDR2_INTERFACE.DDR_WE  [project net DDR2.DDR_WE]
FJTAG_TCK: FJTAG.4(TCK) FPGA.A17(TCK)
FJTAG_TDI: FJTAG.3(TDI) FPGA.D15(TDI)
FJTAG_TDO: FJTAG.2(TDO) FPGA.D16(TDO)
FJTAG_TMS: FJTAG.1(TMS) FPGA.B18(TMS)
FLED0: F0.1(A) FPGA.N2(IO_L35P_M3DQ10_3)
FLED1: F1.1(A) FPGA.N1(IO_L35N_M3DQ11_3)
FLED2: F2.1(A) FPGA.M3(IO_L36P_M3DQ8_3)
FLED3: F3.1(A) FPGA.M1(IO_L36N_M3DQ9_3)
FPGA_ADDR0: FPGA.V5(IO_L49N_D4_2)  [project net ADDR0]
FPGA_ADDR1: FPGA.V4(IO_L63N_2)  [project net ADDR1]
FPGA_ADDR2: FPGA.V3(IO_L65N_CSO_B_2)  [project net ADDR2]
FPGA_ADDR3: FPGA.N6(IO_L47P_2)  [project net ADDR3]
FPGA_ADDR4: FPGA.V6(IO_L45N_2)  [project net ADDR4]
FPGA_ADDR5: FPGA.P6(IO_L64N_D9_2)  [project net ADDR5]
FPGA_ADDR6: FPGA.V7(IO_L43N_2)  [project net ADDR6]
FPGA_ADDR7: FPGA.V11(IO_L23N_2)  [project net ADDR7]
FPGA_ADDR8: FPGA.V10(IO_L30N_GCLK0_USERCCLK_2)  [project net ADDR8]
FPGA_ADDR9: FPGA.N9(IO_L22N_2)  [project net ADDR9]
FPGA_ADDR10: FPGA.V9(IO_L32N_GCLK28_2)  [project net ADDR10]
FPGA_ADDR11: FPGA.V8(IO_L41N_VREF_2)  [project net ADDR11]
FPGA_ADDR12: FPGA.R7(IO_L46P_2)  [project net ADDR12]
FPGA_ADDR13: FPGA.N8(IO_L40N_2)  [project net ADDR13]
FPGA_ADDR14: FPGA.T9(IO_L32P_GCLK29_2)  [project net ADDR14]
FPGA_ADDR15: FPGA.M10(IO_L22P_2)  [project net ADDR15]
FPGA_ADDR16: FPGA.T4(IO_L63P_2)  [project net ADDR16]
FPGA_ADDR17: FPGA.R3(IO_L62P_D5_2)  [project net ADDR17]
FPGA_ADDR18: FPGA.T3(IO_L62N_D6_2)  [project net ADDR18]
FPGA_ADDR19: FPGA.T6(IO_L45P_2)  [project net ADDR19]
FPGA_ADDR20: FPGA.P7(IO_L47N_2)  [project net ADDR20]
FPGA_CCLK: FPGA.R15(IO_L1P_CCLK_2) R4.2 R5.2 ; port FPGA_PROGRAM.CCLK  [also labelled PROG_CLK]
FPGA_DATA0: FPGA.V13(IO_L14N_D12_2)  [project net DATA0]
FPGA_DATA1: FPGA.R11(IO_L16P_2)  [project net DATA1]
FPGA_DATA2: FPGA.U13(IO_L14P_D11_2)  [project net DATA2]
FPGA_DATA3: FPGA.T10(IO_L29N_GCLK2_2)  [project net DATA3]
FPGA_DATA4: FPGA.U11(IO_L23P_2)  [project net DATA4]
FPGA_DATA5: FPGA.T8(IO_L31N_GCLK30_D15_2)  [project net DATA5]
FPGA_DATA6: FPGA.R8(IO_L31P_GCLK31_D14_2)  [project net DATA6]
FPGA_DATA7: FPGA.U8(IO_L41P_2)  [project net DATA7]
FPGA_DATA8: FPGA.T7(IO_L46N_2)  [project net DATA8]
FPGA_DATA9: FPGA.U7(IO_L43P_2)  [project net DATA9]
FPGA_DATA10: FPGA.N7(IO_L44P_2)  [project net DATA10]
FPGA_DATA11: FPGA.R5(IO_L48P_D7_2)  [project net DATA11]
FPGA_DATA12: FPGA.U5(IO_L49P_D3_2)  [project net DATA12]
FPGA_DATA13: FPGA.M8(IO_L40P_2)  [project net DATA13]
FPGA_DATA14: FPGA.N5(IO_L64P_D8_2)  [project net DATA14]
FPGA_DATA15: FPGA.T5(IO_L48N_RDWR_B_VREF_2)  [project net DATA15]
FPGA_DIN: FPGA.R13(IO_L3P_D0_DIN_MISO_MISO1_2) ; port FPGA_PROGRAM.DATA
FPGA_DONE: FPGA.V17(DONE_2) R1#1.2 ; port FPGA_PROGRAM.DONE
FPGA_INIT_B: FPGA.U3(IO_L65P_INIT_B_2) R3.2 ; port FPGA_PROGRAM.INIT_B
FPGA_PROG_B: FPGA.V2(PROGRAM_B_2) R2#1.2 ; port FPGA_PROGRAM.PROGRAM_B
FPGA_READ: FPGA.V16(IO_L2N_CMPMOSI_2) ; port EBI.READ  [project net EBI.READ]
FPGA_READY: FPGA.T12(IO_L19P_2) ; port FPGA_READY0
FPGA_SELECT: FPGA.V14(IO_L12N_D2_MISO3_2) ; port EBI.SELECT0  [project net EBI.SELECT0]
FPGA_WRITE: FPGA.V15(IO_L5N_2) ; port EBI.WRITE  [project net EBI.WRITE]
HE2: FPGA.P8(IO_L44N_2)
HE3: FPGA.U10(IO_L30P_GCLK1_D13_2)
HE4: FPGA.P11(IO_L20N_2)
HE5: FPGA.N10(IO_L20P_2)
HE6: FPGA.V12(IO_L19N_2)
HE7: FPGA.T11(IO_L16N_VREF_2)
HE8: FPGA.N11(IO_L15N_2)
HE9: FPGA.M11(IO_L15P_2)
HE10: FPGA.P12(IO_L13N_D10_2)
HE11: FPGA.T14(IO_L12P_D1_MISO2_2)
HE12: FPGA.U15(IO_L5P_2)
HE13: FPGA.T13(IO_L3N_MOSI_CSI_B_MISO0_2)
HE14: FPGA.U16(IO_L2P_CMPCLK_2)
HE15: FPGA.P3(IO_L2N_3)
HE16: FPGA.L6(IO_L31P_3)
HE17: FPGA.U2(IO_L32P_M3DQ14_3)
HE18: FPGA.U1(IO_L32N_M3DQ15_3)
HE19: FPGA.T2(IO_L33P_M3DQ12_3)
HE20: FPGA.T1(IO_L33N_M3DQ13_3)
HE21: FPGA.P2(IO_L34P_M3UDQS_3)
HE22: FPGA.P1(IO_L34N_M3UDQSN_3)
HN0: FPGA.F15(IO_L1P_A25_1)
HN1: FPGA.F16(IO_L1N_A24_VREF_1)
HN2: FPGA.C17(IO_L29P_A23_M1A13_1)
HN3: FPGA.C18(IO_L29N_A22_M1A14_1)
HN4: FPGA.F14(IO_L30P_A21_M1RESET_1)
HN5: FPGA.G14(IO_L30N_A20_M1A11_1)
HN6: FPGA.D17(IO_L31P_A19_M1CKE_1)
HN7: FPGA.D18(IO_L31N_A18_M1A12_1)
HN8: FPGA.H12(IO_L32P_A17_M1A8_1)
HN9: FPGA.G13(IO_L32N_A16_M1A9_1)
HN10: FPGA.E16(IO_L33P_A15_M1A10_1)
HN11: FPGA.E18(IO_L33N_A14_M1A4_1)
HN12: FPGA.K12(IO_L34P_A13_M1WE_1)
HN13: FPGA.K13(IO_L34N_A12_M1BA2_1)
HN14: FPGA.F17(IO_L35P_A11_M1A7_1)
HN15: FPGA.F18(IO_L35N_A10_M1A2_1)
HN16: FPGA.H13(IO_L36P_A9_M1BA0_1)
HN17: FPGA.H14(IO_L36N_A8_M1BA1_1)
HN18: FPGA.H15(IO_L37P_A7_M1A0_1)
HN19: FPGA.H16(IO_L37N_A6_M1A1_1)
HN20: FPGA.G16(IO_L38P_A5_M1CLK_1)
HN21: FPGA.G18(IO_L38N_A4_M1CLKN_1)
HN22: FPGA.J13(IO_L39P_M1A3_1)
HN23: FPGA.K14(IO_L39N_M1ODT_1)
HN24: FPGA.L12(IO_L40P_GCLK11_M1A5_1)
HN25: FPGA.L13(IO_L40N_GCLK10_M1A6_1)
HN26: FPGA.K15(IO_L41P_GCLK9_IRDY1_M1RASN_1)
HN27: FPGA.K16(IO_L41N_GCLK8_M1CASN_1)
HN28: FPGA.L15(IO_L42P_GCLK7_M1UDM_1)
HN29: FPGA.L16(IO_L42N_GCLK6_TRDY1_M1LDM_1)
HN30: FPGA.H17(IO_L43P_GCLK5_M1DQ4_1)
HN31: FPGA.H18(IO_L43N_GCLK4_M1DQ5_1)
HN32: FPGA.J16(IO_L44P_A3_M1DQ6_1)
HN33: FPGA.J18(IO_L44N_A2_M1DQ7_1)
HN34: FPGA.K17(IO_L45P_A1_M1LDQS_1)
HN35: FPGA.K18(IO_L45N_A0_M1LDQSN_1)
HN36: FPGA.L17(IO_L46P_FCS_B_M1DQ2_1)
HN37: FPGA.L18(IO_L46N_FOE_B_M1DQ3_1)
HN38: FPGA.M16(IO_L47P_FWE_B_M1DQ0_1)
HN39: FPGA.M18(IO_L47N_LDC_M1DQ1_1)
HN40: FPGA.N17(IO_L48P_HDC_M1DQ8_1)
HN41: FPGA.N18(IO_L48N_M1DQ9_1)
HN42: FPGA.P17(IO_L49P_M1DQ10_1)
HN43: FPGA.P18(IO_L49N_M1DQ11_1)
HN44: FPGA.N15(IO_L50P_M1UDQS_1)
HN45: FPGA.N16(IO_L50N_M1UDQSN_1)
HN46: FPGA.T17(IO_L51P_M1DQ12_1)
HN47: FPGA.T18(IO_L51N_M1DQ13_1)
HN48: FPGA.U17(IO_L52P_M1DQ14_1)
HN49: FPGA.U18(IO_L52N_M1DQ15_1)
HN50: FPGA.M14(IO_L53P_1)
HN51: FPGA.N14(IO_L53N_VREF_1)
HN52: FPGA.L14(IO_L61P_1)
HN53: FPGA.M13(IO_L61N_1)
HN54: FPGA.P15(IO_L74P_AWAKE_1)
HN55: FPGA.P16(IO_L74N_DOUT_BUSY_1)
HW0: FPGA.A16(IO_L66N_SCP0_0)
HW1: FPGA.B16(IO_L66P_SCP1_0)
HW2: FPGA.C14(IO_L65N_SCP2_0)
HW3: FPGA.D14(IO_L65P_SCP3_0)
HW4: FPGA.A15(IO_L64N_SCP4_0)
HW5: FPGA.C15(IO_L64P_SCP5_0)
HW6: FPGA.E13(IO_L63N_SCP6_0)
HW7: FPGA.F13(IO_L63P_SCP7_0)
HW8: FPGA.A14(IO_L62N_VREF_0)
HW9: FPGA.B14(IO_L62P_0)
HW10: FPGA.E12(IO_L51N_0)
HW11: FPGA.F12(IO_L51P_0)
HW12: FPGA.A13(IO_L50N_0)
HW13: FPGA.C13(IO_L50P_0)
HW14: FPGA.C12(IO_L47N_0)
HW15: FPGA.D12(IO_L47P_0)
HW16: FPGA.E11(IO_L42N_0)
HW17: FPGA.F11(IO_L42P_0)
HW18: FPGA.A12(IO_L41N_0)
HW19: FPGA.B12(IO_L41P_0)
HW20: FPGA.F10(IO_L40N_0)
HW21: FPGA.G11(IO_L40P_0)
HW22: FPGA.A11(IO_L39N_0)
HW23: FPGA.B11(IO_L39P_0)
HW24: FPGA.F9(IO_L38N_VREF_0)
HW25: FPGA.G9(IO_L38P_0)
HW26: FPGA.A10(IO_L37N_GCLK12_0)
HW27: FPGA.C10(IO_L37P_GCLK13_0)
HW28: FPGA.C11(IO_L36N_GCLK14_0)
HW29: FPGA.D11(IO_L36P_GCLK15_0)
HW30: FPGA.A9(IO_L35N_GCLK16_0)
HW31: FPGA.B9(IO_L35P_GCLK17_0)
HW32: FPGA.C9(IO_L34N_GCLK18_0)
HW33: FPGA.D9(IO_L34P_GCLK19_0)
HW34: FPGA.A8(IO_L33N_0)
HW35: FPGA.B8(IO_L33P_0)
HW36: FPGA.C8(IO_L11N_0)
HW37: FPGA.D8(IO_L11P_0)
HW38: FPGA.A7(IO_L10N_0)
HW39: FPGA.C7(IO_L10P_0)
HW40: FPGA.A6(IO_L8N_VREF_0)
HW41: FPGA.B6(IO_L8P_0)
HW42: FPGA.A5(IO_L6N_0)
HW43: FPGA.C5(IO_L6P_0)
HW44: FPGA.A4(IO_L5N_0)
HW45: FPGA.B4(IO_L5P_0)
HW46: FPGA.A3(IO_L4N_0)
HW47: FPGA.B3(IO_L4P_0)
HW48: FPGA.C6(IO_L3N_0)
HW49: FPGA.D6(IO_L3P_0)
HW50: FPGA.A2(IO_L2N_0)
HW51: FPGA.B2(IO_L2P_0)
HW52: FPGA.C4(IO_L1N_VREF_0)
NetFPGA_R10: FPGA.R10(IO_L29P_GCLK3_2) ; port DDR_SYS_CLKP

Not connected (* = marked no-connect by the designer): FPGA C2(IO_L83P_3)* E2(VCCO_3) E4(IO_L54P_M3RESET_3)* E6(NC)* E7(NC)* E8(NC)* F5(IO_L55N_M3A14_3)* F7(NC)* F8(NC)* G4(VCCO_3) G8(NC)* J2(VCCO_3) J5(VCCO_3) K4(IO_L42P_GCLK25_TRDY2_M3UDM_3)* M4(VCCO_3) P4(IO_L2P_3)* P13(CMPCS_B_2)* R2(VCCO_3)

### Buses and harness runs
bus DDR_A[13..0]
bus DDR_DQ[7..0]
bus FPGA_ADDR[20..0]
bus FPGA_DATA[15..0]
bus HE[0..24]
bus HE[24..0]
bus HN[55..0]
bus HW[52..0]

### Notes on the sheet
- Toplevel Schematic for FPGA - Spartan 6 LXxx-2CSG324
- EBI Interface
- DDR2 Interface
- FPGA Slave Serial
- Labels drawn without touching a wire or pin: 3V3
- (in symbol CMP-0067-00428-1, part A) BANK 0
- (in symbol CMP-0067-00428-1, part B) BANK 1
- (in symbol CMP-0067-00428-1, part C) BANK 2
- (in symbol CMP-0067-00428-1, part D) BANK 3

### Library data of the parts
F0-F3 = LED2: as U0 on sheet efn32gg990; Published: 8-Jun-2000; LatestRevisionDate: 17-Jul-2002; LatestRevisionNote: Re-released for DXP Platform.; PackageVersion: Feb-2002; PackageReference: 3.2X1.6X1.1; Publisher: Altium Limited; PackageDescription: SM LED; 2 Flat Leads
FJTAG = Header 4: Header, 4-Pin; LatestRevisionDate: 17-Jul-2002; LatestRevisionNote: Re-released for DXP Platform.; Publisher: Altium Limited
FPGA = CMP-0067-00428-1: Spartan-6 LX 1.2V FPGA, 226 User I/Os, 324-Ball Chip-Scale BGA (0.8mm Pitch), Speed Grade 2, Industrial Grade, Pb-Free; PackageVersion: ver1.1, Nov-2009; DatasheetVersion: ver1.6, Nov-2010; PackageDescription: 324-Ball Chip-Scale BGA (CSG324) Package, 0.8 mm Pitch; Code_JEDEC: MO-275-KKAC-1; PackageReference: CSG324
R1#1 R2#1 R3-R5 = Res3: Resistor; Published: 8-Jun-2000; LatestRevisionDate: 29-May-2009; LatestRevisionNote: IPC-7351 Footprint Added.; PackageReference: J1-0603; Publisher: Altium Limited; PackageDescription: Chip Resistor

## Sheet psu.SchDoc
size A
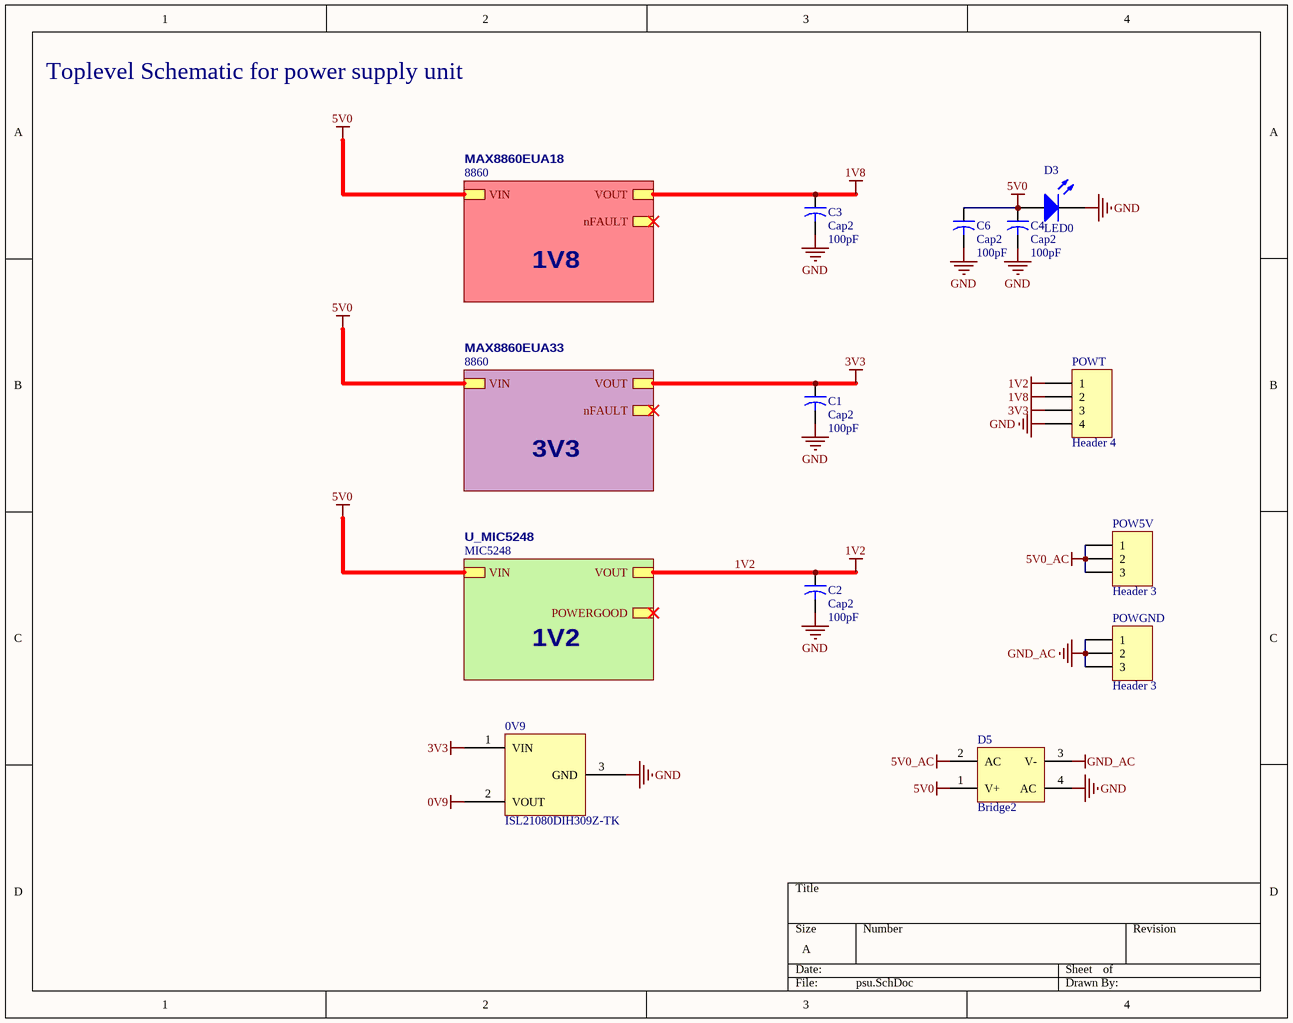
[diagram p7: psu.SchDoc]

### Parts
(Parts that share a designator on the sheet are numbered #1, #2 ... from top to bottom, then left to right.)
0V9  ISL21080DIH309Z-TK
C1#1  Cap2  value 100pF  [CAPR5-4X5]
C2#1  Cap2  value 100pF  [CAPR5-4X5]
C3#1  Cap2  value 100pF  [CAPR5-4X5]
C4#1  Cap2  value 100pF  [CAPR5-4X5]
C6#1  Cap2  value 100pF  [CAPR5-4X5]
D3  LED0  [LED-0]
D5  Bridge2  [4 in line socket]
POW5V  Header 3  [HDR1X3]
POWGND  Header 3  [HDR1X3]
POWT  Header 4  [HDR1X4]

### Sub-sheets
MAX8860EUA18 = 8860: VIN, VOUT, nFAULT
MAX8860EUA33 = 8860: VIN, VOUT, nFAULT
U_MIC5248 = MIC5248: VIN, VOUT, POWERGOOD

### Nets
0V9: 0V9.2(VOUT)
1V2: C2#1.1 POWT.1 ; sheet U_MIC5248/VOUT
1V8: C3#1.1 POWT.2 ; sheet MAX8860EUA18/VOUT
3V3: 0V9.1(VIN) C1#1.1 POWT.3 ; sheet MAX8860EUA33/VOUT
5V0: C4#1.1 C6#1.1 D3.1(A) D5.1(V+) ; sheet MAX8860EUA18/VIN, sheet MAX8860EUA33/VIN, sheet U_MIC5248/VIN
5V0_AC: D5.2(AC) POW5V.1 POW5V.2 POW5V.3
GND: 0V9.3(GND) C1#1.2 C2#1.2 C3#1.2 C4#1.2 C6#1.2 D3.2(K) D5.4(AC) POWT.4
GND_AC: D5.3(V-) POWGND.1 POWGND.2 POWGND.3

### Notes on the sheet
- Toplevel Schematic for power supply unit
- 1V8
- 3V3
- 1V2

### Library data of the parts
C1#1 C2#1 C3#1 C4#1 C6#1 = Cap2: Capacitor; Published: 23-Sep-2002; PackageReference: CAPR5-4X5; Publisher: Altium Limited; PackageDescription: Capacitor; 2 Leads
D3 = LED0: Typical INFRARED GaAs LED; Published: 8-Jun-2000; LatestRevisionDate: 08-Jul-2005; LatestRevisionNote: Mech Layer 1 removed.; PackageReference: LED-0; Publisher: Altium Limited; PackageDescription: LED; 2 Leads
D5 = Bridge2: Diode Bridge; Published: 24-Mar-1999; LatestRevisionDate: 17-Jul-2002; LatestRevisionNote: Re-released for DXP Platform.; PackageReference: D-46_6A; Publisher: Altium Limited; PackageDescription: Bridge Rectifier; 4 Terminals; Body 16.8 x 16.8 mm (typ); Pitch 10.67 mm
POW5V POWGND = Header 3: Header, 3-Pin; LatestRevisionDate: 17-Jul-2002; LatestRevisionNote: Re-released for DXP Platform.; Publisher: Altium Limited
POWT = Header 4: Header, 4-Pin; LatestRevisionDate: 17-Jul-2002; LatestRevisionNote: Re-released for DXP Platform.; Publisher: Altium Limited

## Sheet 8860.SchDoc: 3V3 PSU
size A
Used 2 times, as channels U_psu/MAX8860EUA18, U_psu/MAX8860EUA33. Parts and nets are listed once, with the designators drawn on the sheet.
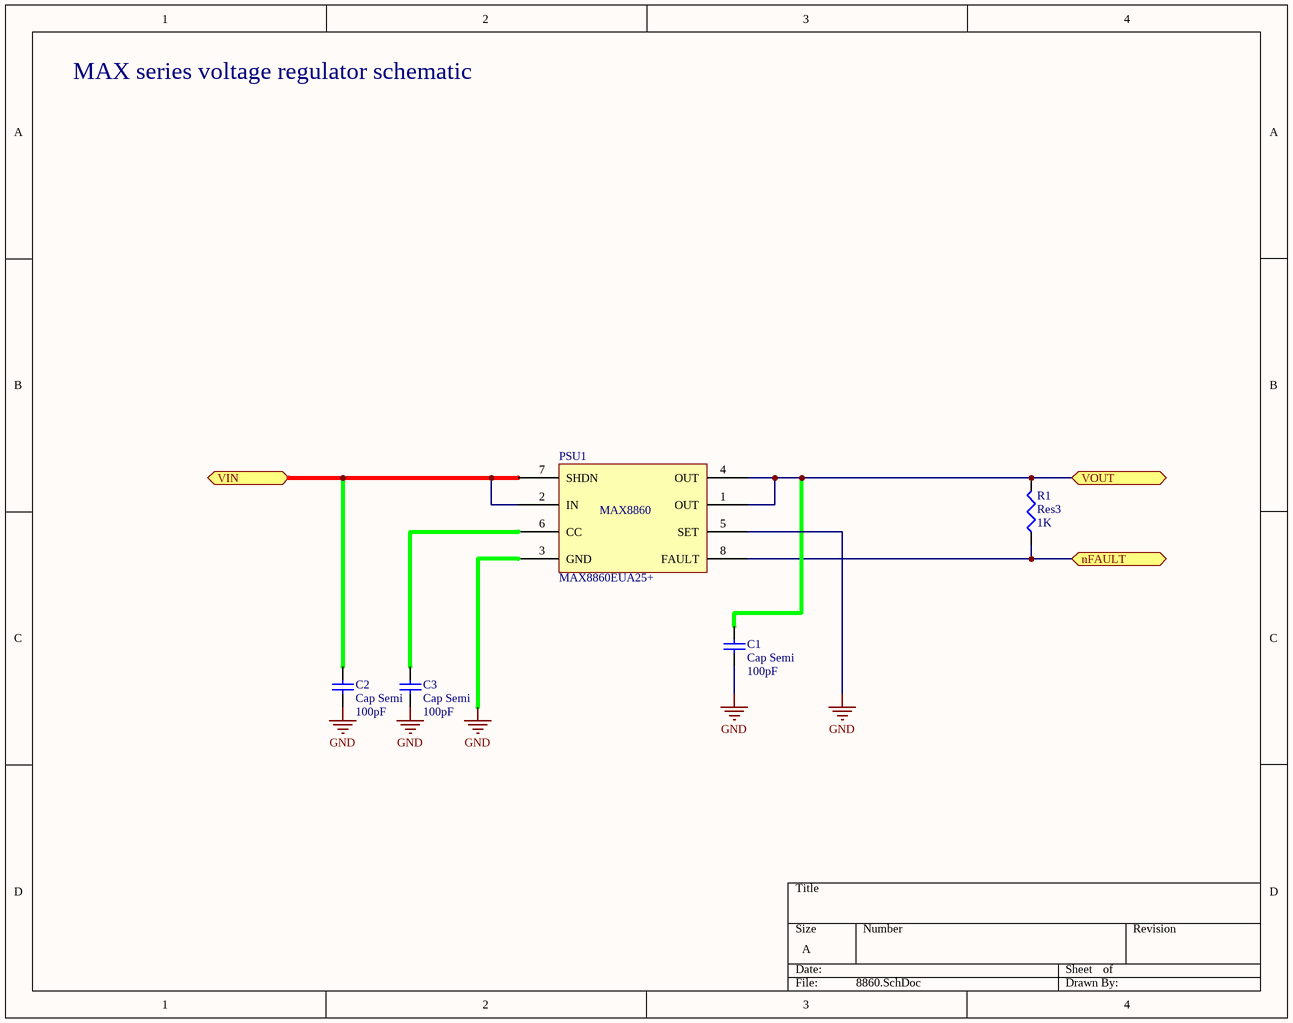
[diagram p8: 8860.SchDoc]

### Parts
C1  Cap Semi  value 100pF  [C1206]
C2  Cap Semi  value 100pF  [C1206]
C3  Cap Semi  value 100pF  [C1206]
PSU1  MAX8860EUA25+  [TSOP65P300X110-8N]
R1  Res3  value 1K  [14-1210]

### Ports
nFAULT, VIN, VOUT

### Nets
GND: C1.1 C2.1 C3.1 PSU1.3(GND) PSU1.5(SET)
nFAULT: PSU1.8(FAULT) R1.1 ; port nFAULT
VIN: C2.2 PSU1.2(IN) PSU1.7(SHDN) ; port VIN
VOUT: C1.2 PSU1.1(OUT) PSU1.4(OUT) R1.2 ; port VOUT
NetC3_2: C3.2 PSU1.6(CC)

### Channels
U_psu/MAX8860EUA18: designators C1=C1#2 C2=C2#2 C3=C3#2 PSU1=PSU1 R1=R1#2; ports nFAULT=NetPSU1_8 VIN=5V0 VOUT=1V8
U_psu/MAX8860EUA33: designators C1=C4#2 C2=C5#1 C3=C6#2 PSU1=PSU2 R1=R2#2; ports nFAULT=NetPSU2_8 VIN=5V0 VOUT=3V3

### Notes on the sheet
- MAX series voltage regulator schematic
- (in symbol MAX8860EUA25+) MAX8860

### Library data of the parts
C1-C3 = Cap Semi: Capacitor (Semiconductor SIM Model); Published: 8-Jun-2000; LatestRevisionDate: 29-May-2009; LatestRevisionNote: IPC-7351 Footprint Added.; PackageReference: C1206; Publisher: Altium Limited; PackageDescription: Chip Capacitor
R1 = Res3: Resistor; Published: 8-Jun-2000; LatestRevisionDate: 29-May-2009; LatestRevisionNote: IPC-7351 Footprint Added.; PackageReference: J1-0603; Publisher: Altium Limited; PackageDescription: Chip Resistor

## Sheet MIC5248.SchDoc
size A
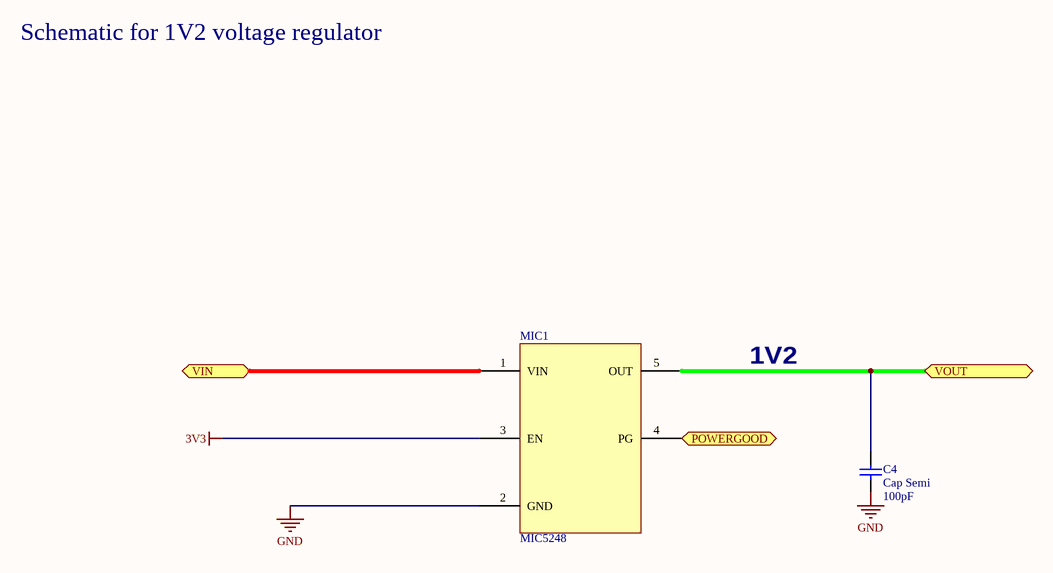
[diagram p9: MIC5248.SchDoc]

### Parts
(Parts that share a designator on the sheet are numbered #1, #2 ... from top to bottom, then left to right.)
C4#3  Cap Semi  value 100pF  [C1206]
MIC1  MIC5248  [SOT95P280X145-5N]

### Ports
POWERGOOD, VIN, VOUT

### Nets
1V2: C4#3.2 MIC1.5(OUT) ; port VOUT
3V3: MIC1.3(EN)
5V0: MIC1.1(VIN) ; port VIN
GND: C4#3.1 MIC1.2(GND)
NetMIC1_4: MIC1.4(PG) ; port POWERGOOD

### Notes on the sheet
- Schematic for 1V2 voltage regulator
- 1V2

### Library data of the parts
C4#3 = Cap Semi: Capacitor (Semiconductor SIM Model); Published: 8-Jun-2000; LatestRevisionDate: 29-May-2009; LatestRevisionNote: IPC-7351 Footprint Added.; PackageReference: C1206; Publisher: Altium Limited; PackageDescription: Chip Capacitor

## Sheet decoupling.SchDoc
size A
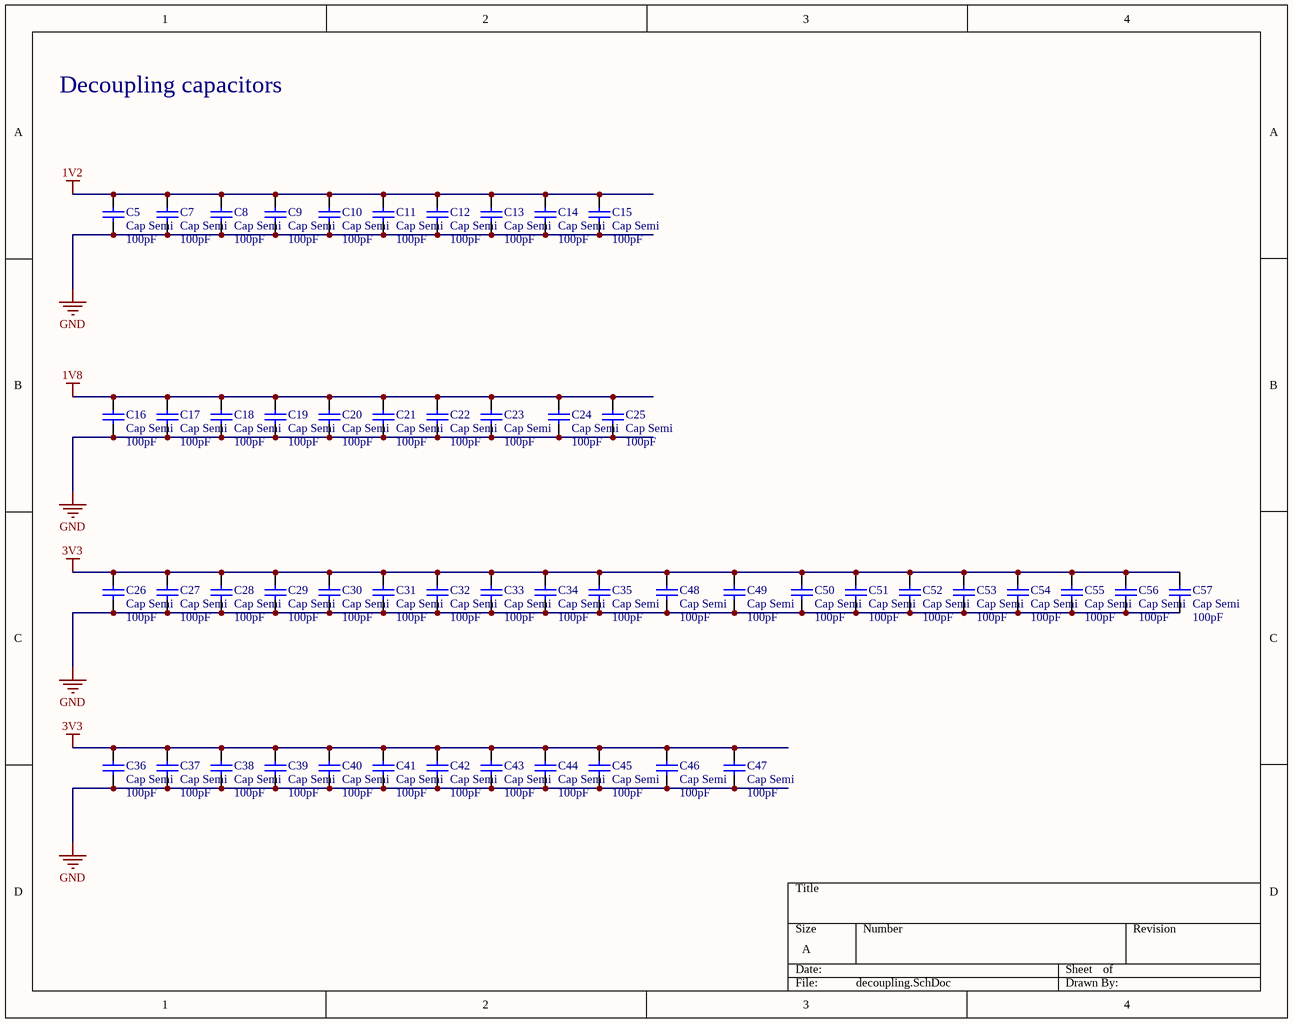
[diagram p10: decoupling.SchDoc]

### Parts
(Parts that share a designator on the sheet are numbered #1, #2 ... from top to bottom, then left to right.)
C5#2  Cap Semi  value 100pF  [C1206]
C7  Cap Semi  value 100pF  [C1206]
C8  Cap Semi  value 100pF  [C1206]
C9  Cap Semi  value 100pF  [C1206]
C10  Cap Semi  value 100pF  [C1206]
C11  Cap Semi  value 100pF  [C1206]
C12  Cap Semi  value 100pF  [C1206]
C13  Cap Semi  value 100pF  [C1206]
C14  Cap Semi  value 100pF  [C1206]
C15  Cap Semi  value 100pF  [C1206]
C16  Cap Semi  value 100pF  [C1206]
C17  Cap Semi  value 100pF  [C1206]
C18  Cap Semi  value 100pF  [C1206]
C19  Cap Semi  value 100pF  [C1206]
C20  Cap Semi  value 100pF  [C1206]
C21  Cap Semi  value 100pF  [C1206]
C22  Cap Semi  value 100pF  [C1206]
C23  Cap Semi  value 100pF  [C1206]
C24  Cap Semi  value 100pF  [C1206]
C25  Cap Semi  value 100pF  [C1206]
C26  Cap Semi  value 100pF  [C1206]
C27  Cap Semi  value 100pF  [C1206]
C28  Cap Semi  value 100pF  [C1206]
C29  Cap Semi  value 100pF  [C1206]
C30  Cap Semi  value 100pF  [C1206]
C31  Cap Semi  value 100pF  [C1206]
C32  Cap Semi  value 100pF  [C1206]
C33  Cap Semi  value 100pF  [C1206]
C34  Cap Semi  value 100pF  [C1206]
C35  Cap Semi  value 100pF  [C1206]
C36  Cap Semi  value 100pF  [C1206]
C37  Cap Semi  value 100pF  [C1206]
C38  Cap Semi  value 100pF  [C1206]
C39  Cap Semi  value 100pF  [C1206]
C40  Cap Semi  value 100pF  [C1206]
C41  Cap Semi  value 100pF  [C1206]
C42  Cap Semi  value 100pF  [C1206]
C43  Cap Semi  value 100pF  [C1206]
C44  Cap Semi  value 100pF  [C1206]
C45  Cap Semi  value 100pF  [C1206]
C46  Cap Semi  value 100pF  [C1206]
C47  Cap Semi  value 100pF  [C1206]
C48  Cap Semi  value 100pF  [C1206]
C49  Cap Semi  value 100pF  [C1206]
C50  Cap Semi  value 100pF  [C1206]
C51  Cap Semi  value 100pF  [C1206]
C52  Cap Semi  value 100pF  [C1206]
C53  Cap Semi  value 100pF  [C1206]
C54  Cap Semi  value 100pF  [C1206]
C55  Cap Semi  value 100pF  [C1206]
C56  Cap Semi  value 100pF  [C1206]
C57  Cap Semi  value 100pF  [C1206]

### Nets
1V2: C5#2.2 C7.2 C8.2 C9.2 C10.2 C11.2 C12.2 C13.2 C14.2 C15.2
1V8: C16.2 C17.2 C18.2 C19.2 C20.2 C21.2 C22.2 C23.2 C24.2 C25.2
3V3: C26.2 C27.2 C28.2 C29.2 C30.2 C31.2 C32.2 C33.2 C34.2 C35.2 C36.2 C37.2 C38.2 C39.2 C40.2 C41.2 C42.2 C43.2 C44.2 C45.2 C46.2 C47.2 C48.1 C49.2 C50.2 C51.2 C52.2 C53.2 C54.2 C55.2 C56.2 C57.2
GND: C5#2.1 C7.1 C8.1 C9.1 C10.1 C11.1 C12.1 C13.1 C14.1 C15.1 C16.1 C17.1 C18.1 C19.1 C20.1 C21.1 C22.1 C23.1 C24.1 C25.1 C26.1 C27.1 C28.1 C29.1 C30.1 C31.1 C32.1 C33.1 C34.1 C35.1 C36.1 C37.1 C38.1 C39.1 C40.1 C41.1 C42.1 C43.1 C44.1 C45.1 C46.1 C47.1 C48.2 C49.1 C50.1 C51.1 C52.1 C53.1 C54.1 C55.1 C56.1 C57.1

### Notes on the sheet
- Decoupling capacitors

### Library data of the parts
C5#2 C7-C57 = Cap Semi: Capacitor (Semiconductor SIM Model); Published: 8-Jun-2000; LatestRevisionDate: 29-May-2009; LatestRevisionNote: IPC-7351 Footprint Added.; PackageReference: C1206; Publisher: Altium Limited; PackageDescription: Chip Capacitor

## Sheet ddr2_memory.SchDoc
size A
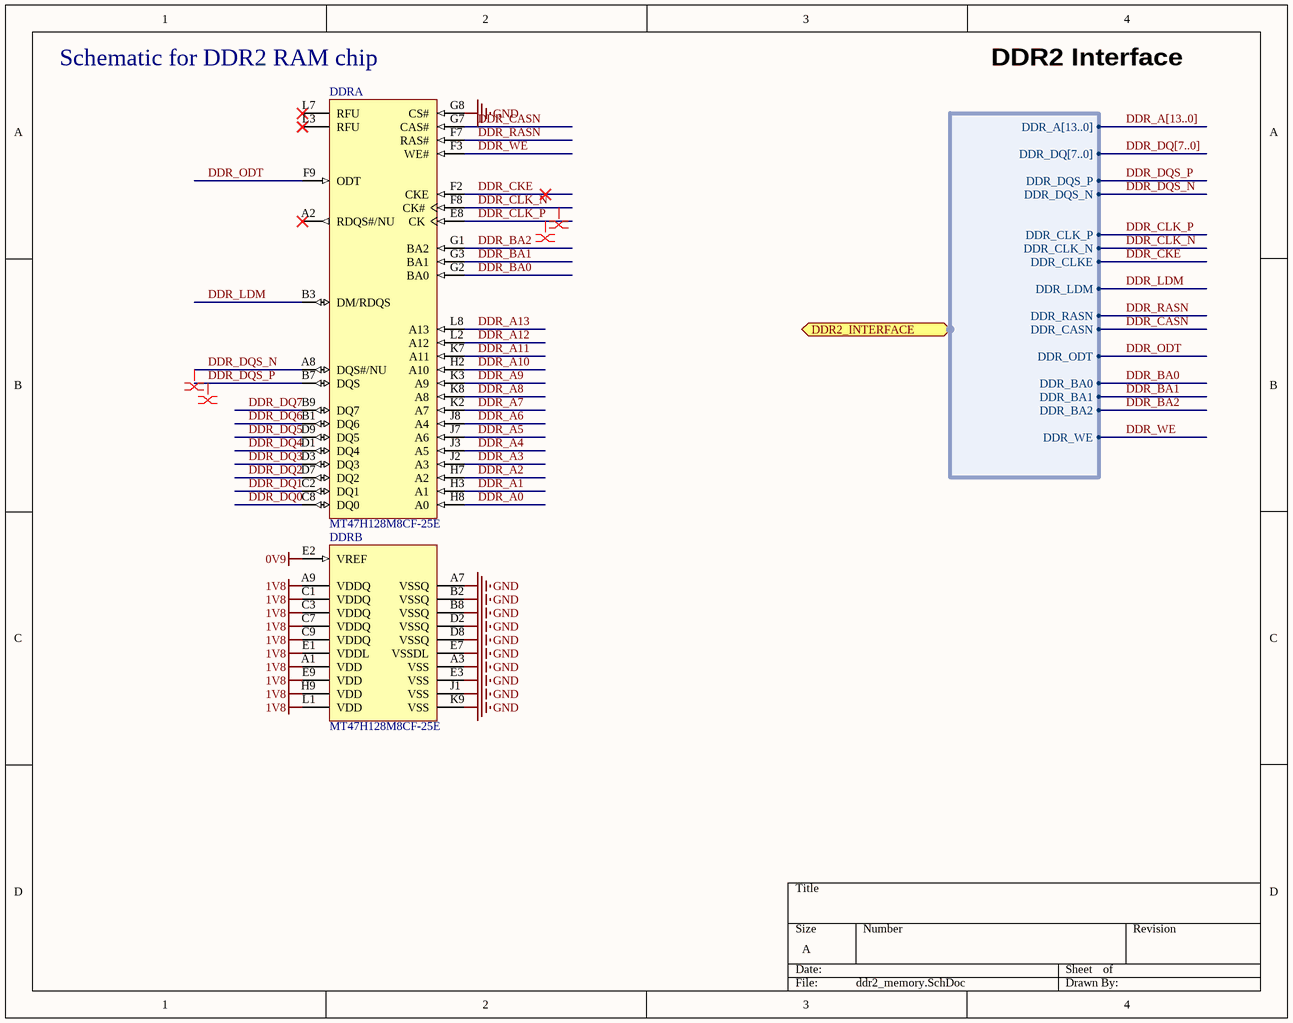
[diagram p11: ddr2_memory.SchDoc]

### Parts
DDR  MT47H128M8CF-25E  [MICT-CF-60]  (parts A,B of 2)

### Ports
DDR2_INTERFACE (harness DDR2_INTERFACE)

### Harnesses
DDR2_INTERFACE: DDR_A[13..0], DDR_DQ[7..0], DDR_DQS_P, DDR_DQS_N, DDR_CLK_P, DDR_CLK_N, DDR_LDM, DDR_RASN, DDR_CASN, DDR_ODT, DDR_BA0, DDR_BA1, DDR_BA2, DDR_WE, DDR_CLKE

### Nets
0V9: DDR.E2(VREF)
1V8: DDR.A1(VDD) DDR.A9(VDDQ) DDR.C1(VDDQ) DDR.C3(VDDQ) DDR.C7(VDDQ) DDR.C9(VDDQ) DDR.E1(VDDL) DDR.E9(VDD) DDR.H9(VDD) DDR.L1(VDD)
GND: DDR.A3(VSS) DDR.A7(VSSQ) DDR.B2(VSSQ) DDR.B8(VSSQ) DDR.D2(VSSQ) DDR.D8(VSSQ) DDR.E3(VSS) DDR.E7(VSSDL) DDR.G8(CS#) DDR.J1(VSS) DDR.K9(VSS)
DDR_A0: DDR.H8(A0)
DDR_A1: DDR.H3(A1)
DDR_A2: DDR.H7(A2)
DDR_A3: DDR.J2(A3)
DDR_A4: DDR.J3(A5)
DDR_A5: DDR.J7(A6)
DDR_A6: DDR.J8(A4)
DDR_A7: DDR.K2(A7)
DDR_A8: DDR.K8(A8)
DDR_A9: DDR.K3(A9)
DDR_A10: DDR.H2(A10)
DDR_A11: DDR.K7(A11)
DDR_A12: DDR.L2(A12)
DDR_A13: DDR.L8(A13)
DDR_BA0: DDR.G2(BA0) ; port DDR2_INTERFACE.DDR_BA0  [project net DDR2.DDR_BA0]
DDR_BA1: DDR.G3(BA1) ; port DDR2_INTERFACE.DDR_BA1  [project net DDR2.DDR_BA1]
DDR_BA2: DDR.G1(BA2) ; port DDR2_INTERFACE.DDR_BA2  [project net DDR2.DDR_BA2]
DDR_CASN: DDR.G7(CAS#) ; port DDR2_INTERFACE.DDR_CASN  [project net DDR2.DDR_CASN]
DDR_CKE: DDR.F2(CKE) ; port DDR2_INTERFACE.DDR_CLKE  [project net DDR2.DDR_CLKE]
DDR_CLK_N: DDR.F8(CK#) ; port DDR2_INTERFACE.DDR_CLK_N  [project net DDR2.DDR_CLK_N]
DDR_CLK_P: DDR.E8(CK) ; port DDR2_INTERFACE.DDR_CLK_P  [project net DDR2.DDR_CLK_P]
DDR_DQ0: DDR.C8(DQ0)
DDR_DQ1: DDR.C2(DQ1)
DDR_DQ2: DDR.D7(DQ2)
DDR_DQ3: DDR.D3(DQ3)
DDR_DQ4: DDR.D1(DQ4)
DDR_DQ5: DDR.D9(DQ5)
DDR_DQ6: DDR.B1(DQ6)
DDR_DQ7: DDR.B9(DQ7)
DDR_DQS_N: DDR.A8(DQS#/NU) ; port DDR2_INTERFACE.DDR_DQS_N  [project net DDR2.DDR_DQS_N]
DDR_DQS_P: DDR.B7(DQS) ; port DDR2_INTERFACE.DDR_DQS_P  [project net DDR2.DDR_DQS_P]
DDR_LDM: DDR.B3(DM/RDQS) ; port DDR2_INTERFACE.DDR_LDM  [project net DDR2.DDR_LDM]
DDR_ODT: DDR.F9(ODT) ; port DDR2_INTERFACE.DDR_ODT  [project net DDR2.DDR_ODT]
DDR_RASN: DDR.F7(RAS#) ; port DDR2_INTERFACE.DDR_RASN  [project net DDR2.DDR_RASN]
DDR_WE: DDR.F3(WE#) ; port DDR2_INTERFACE.DDR_WE  [project net DDR2.DDR_WE]

Not connected (* = marked no-connect by the designer): DDR A2(RDQS#/NU)* L3(RFU)* L7(RFU)*

### Buses and harness runs
bus DDR_A[13..0]
bus DDR_DQ[7..0]

### Layout directives
differential pair: DDR2.DDR_CLK_N, DDR2.DDR_CLK_P, DDR2.DDR_DQS_N, DDR2.DDR_DQS_P

### Notes on the sheet
- (near DDR) Schematic for DDR2 RAM chip
- DDR2 Interface

### Library data of the parts
DDR = CMP-0354-00001-1: 1Gb DDR2-800 SDRAM, 128Mb x 8, 2.5ns, 1.8V, 0 to 85 degC, 60-Ball FBGA, Pb-Free; Manufacturer: Micron; Clock Rate: 400 MHz; CL: CL = 5; Op. Temp.: 0C to +85C; ComponentLink2URL: http://www.micron.com/~/media/Documents/Products/Data%20Sheet/DRAM/1Gb_DDR2.pdf; ComponentLink2Description: Datasheet; ComponentLink1URL: http://www.micron.com/; Voltage: 1.8V; PackageReference: MICT-CF-60; ComponentLink1Description: Manufacturer URL; Density: 1Gb; Package: FBGA; Data Rate: DDR2-800; Pin Count: 60-ball; Mounting Technology: Surface Mount; RoHS: Yes; Width: x8; DatasheetVersion: Rev.X; ComponentLink3URL: http://www.micron.com/~/media/Documents/Products/Data%20Sheet/DRAM/1Gb_1_55V_DDR2.pdf; PackageVersion: Rev.D; PartNumber: MT47H128M8CF-25E; ComponentLink3Description: Package Specification; PackageDescription: 60-Ball Fine-Pitch Ball Grid Array, 10 x 8 mm, Pitch 0.8 mm; Depth: 128Mb; Cycle Time: 2.5ns

## Sheet headers.SchDoc
size B
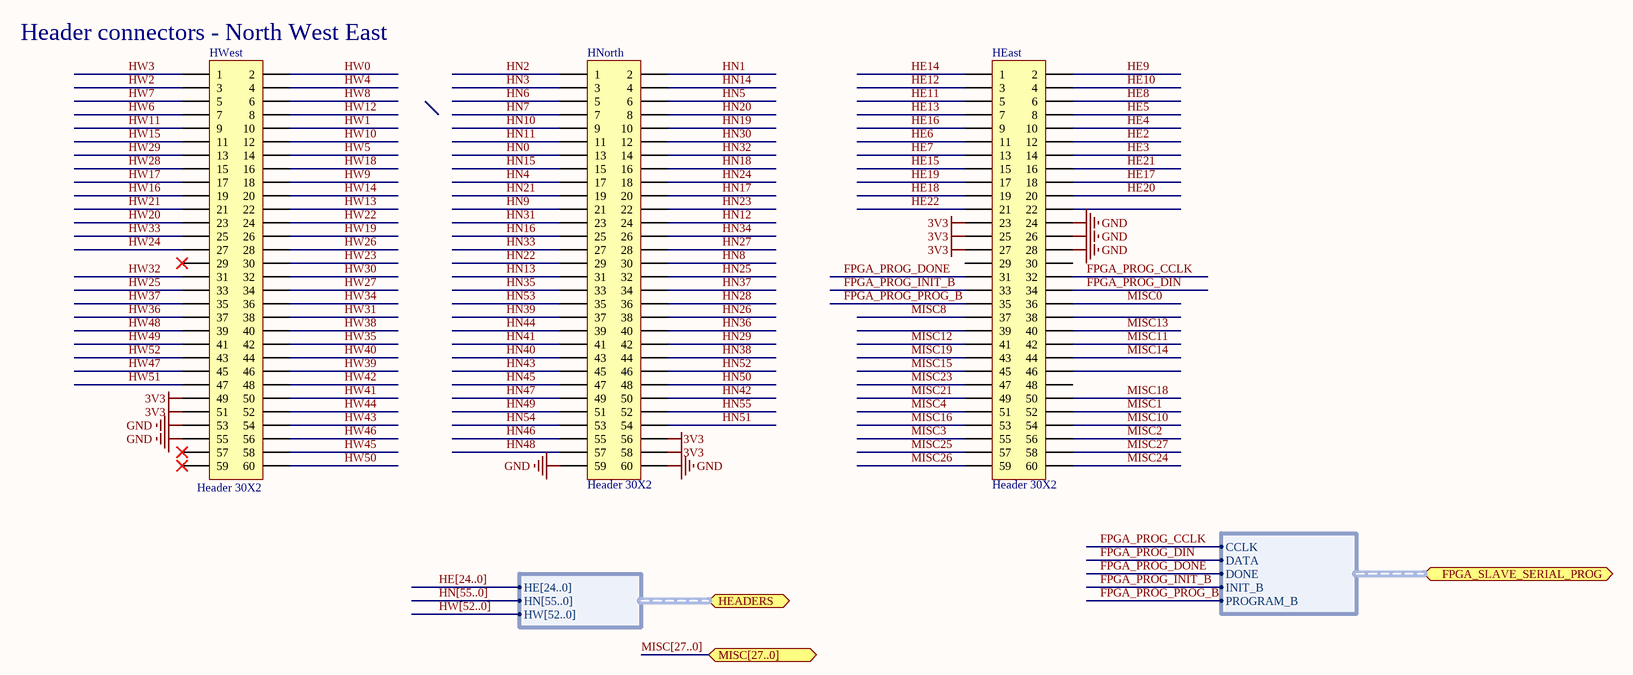
[diagram p12: headers.SchDoc]

### Parts
HEast  Header 30X2  [HDR2X30]
HNorth  Header 30X2  [HDR2X30]
HWest  Header 30X2  [HDR2X30]

### Ports
FPGA_SLAVE_SERIAL_PROG (harness FPGA_SLAVE_SERIAL_PROG), HEADERS (harness HEADERS), MISC[27..0]

### Harnesses
HEADERS: HE[24..0], HN[55..0], HW[52..0]
FPGA_SLAVE_SERIAL_PROG: CCLK, DATA, DONE, INIT_B, PROGRAM_B

### Nets
3V3: HEast.23 HEast.25 HEast.27 HNorth.56 HNorth.58 HWest.49 HWest.51
GND: HEast.24 HEast.26 HEast.28 HNorth.59 HNorth.60 HWest.53 HWest.55
FPGA_PROG_CCLK: HEast.32 ; port FPGA_SLAVE_SERIAL_PROG.CCLK  [project net FPGA_CCLK]
FPGA_PROG_DIN: HEast.34 ; port FPGA_SLAVE_SERIAL_PROG.DATA  [project net FPGA_DIN]
FPGA_PROG_DONE: HEast.31 ; port FPGA_SLAVE_SERIAL_PROG.DONE  [project net FPGA_DONE]
FPGA_PROG_INIT_B: HEast.33 ; port FPGA_SLAVE_SERIAL_PROG.INIT_B  [project net FPGA_INIT_B]
FPGA_PROG_PROG_B: HEast.35 ; port FPGA_SLAVE_SERIAL_PROG.PROGRAM_B  [project net FPGA_PROG_B]
HE2: HEast.12
HE3: HEast.14
HE4: HEast.10
HE5: HEast.8
HE6: HEast.11
HE7: HEast.13
HE8: HEast.6
HE9: HEast.2
HE10: HEast.4
HE11: HEast.5
HE12: HEast.3
HE13: HEast.7
HE14: HEast.1
HE15: HEast.15
HE16: HEast.9
HE17: HEast.18
HE18: HEast.19
HE19: HEast.17
HE20: HEast.20
HE21: HEast.16
HE22: HEast.21
HN0: HNorth.13
HN1: HNorth.2
HN2: HNorth.1
HN3: HNorth.3
HN4: HNorth.17
HN5: HNorth.6
HN6: HNorth.5
HN7: HNorth.7
HN8: HNorth.30
HN9: HNorth.21
HN10: HNorth.9
HN11: HNorth.11
HN12: HNorth.24
HN13: HNorth.31
HN14: HNorth.4
HN15: HNorth.15
HN16: HNorth.25
HN17: HNorth.20
HN18: HNorth.16
HN19: HNorth.10
HN20: HNorth.8
HN21: HNorth.19
HN22: HNorth.29
HN23: HNorth.22
HN24: HNorth.18
HN25: HNorth.32
HN26: HNorth.38
HN27: HNorth.28
HN28: HNorth.36
HN29: HNorth.42
HN30: HNorth.12
HN31: HNorth.23
HN32: HNorth.14
HN33: HNorth.27
HN34: HNorth.26
HN35: HNorth.33
HN36: HNorth.40
HN37: HNorth.34
HN38: HNorth.44
HN39: HNorth.37
HN40: HNorth.43
HN41: HNorth.41
HN42: HNorth.50
HN43: HNorth.45
HN44: HNorth.39
HN45: HNorth.47
HN46: HNorth.55
HN47: HNorth.49
HN48: HNorth.57
HN49: HNorth.51
HN50: HNorth.48
HN51: HNorth.54
HN52: HNorth.46
HN53: HNorth.35
HN54: HNorth.53
HN55: HNorth.52
HW0: HWest.2
HW1: HWest.10
HW2: HWest.3
HW3: HWest.1
HW4: HWest.4
HW5: HWest.14
HW6: HWest.7
HW7: HWest.5
HW8: HWest.6
HW9: HWest.18
HW10: HWest.12
HW11: HWest.9
HW12: HWest.8
HW13: HWest.22
HW14: HWest.20
HW15: HWest.11
HW16: HWest.19
HW17: HWest.17
HW18: HWest.16
HW19: HWest.26
HW20: HWest.23
HW21: HWest.21
HW22: HWest.24
HW23: HWest.30
HW24: HWest.27
HW25: HWest.33
HW26: HWest.28
HW27: HWest.34
HW28: HWest.15
HW29: HWest.13
HW30: HWest.32
HW31: HWest.38
HW32: HWest.31
HW33: HWest.25
HW34: HWest.36
HW35: HWest.42
HW36: HWest.37
HW37: HWest.35
HW38: HWest.40
HW39: HWest.46
HW40: HWest.44
HW41: HWest.50
HW42: HWest.48
HW43: HWest.54
HW44: HWest.52
HW45: HWest.58
HW46: HWest.56
HW47: HWest.45
HW48: HWest.39
HW49: HWest.41
HW50: HWest.60
HW51: HWest.47
HW52: HWest.43
MISC0: HEast.36
MISC1: HEast.52
MISC2: HEast.56
MISC3: HEast.55
MISC4: HEast.51
MISC8: HEast.37
MISC10: HEast.54
MISC11: HEast.42
MISC12: HEast.41
MISC13: HEast.40
MISC14: HEast.44
MISC15: HEast.45
MISC16: HEast.53
MISC18: HEast.50
MISC19: HEast.43
MISC21: HEast.49
MISC23: HEast.47
MISC24: HEast.60
MISC25: HEast.57
MISC26: HEast.59
MISC27: HEast.58

Not connected (* = marked no-connect by the designer): HEast 22 29 30 38 39 46 48; HWest 29* 57* 59*

### Buses and harness runs
bus HE[24..0]
bus HN[55..0]
bus HW[52..0]
bus MISC[27..0] = port MISC[27..0]

### Notes on the sheet
- (near HWest) Header connectors - North West East

### Library data of the parts
HEast HNorth HWest = Header 30X2: Header, 30-Pin, Dual row; LatestRevisionDate: 17-Jul-2002; LatestRevisionNote: Re-released for DXP Platform.; Publisher: Altium Limited

## Sheet uc_sram.SchDoc
size A
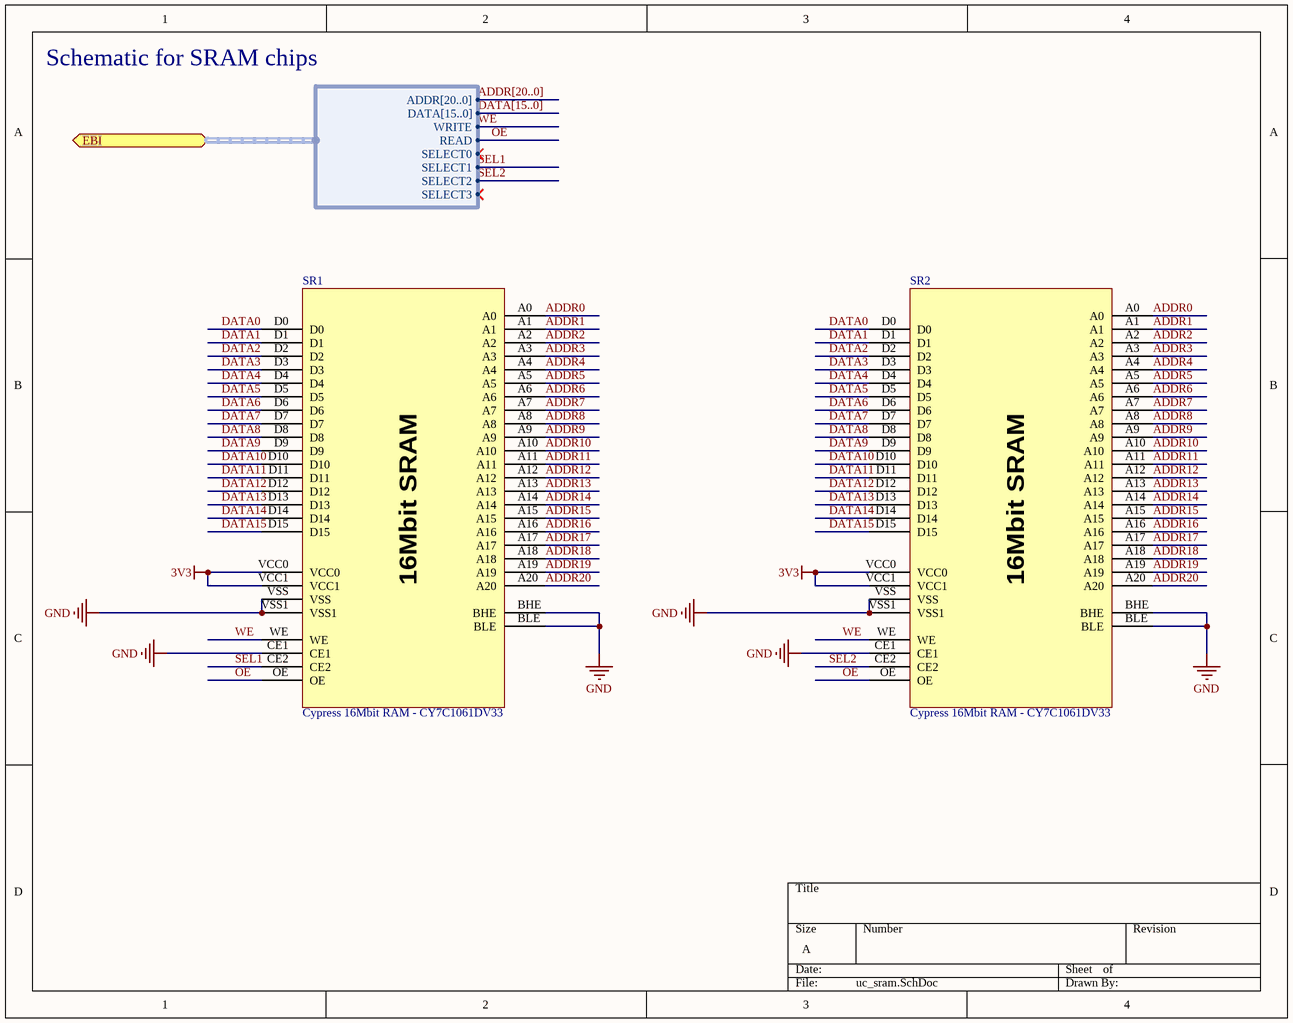
[diagram p13: uc_sram.SchDoc]

### Parts
SR1  Cypress 16Mbit RAM - CY7C1061DV33  [BGA48C75P8X6_950X800X100]
SR2  Cypress 16Mbit RAM - CY7C1061DV33  [BGA48C75P8X6_950X800X100]

### Ports
EBI (harness EBI)

### Harnesses
EBI: ADDR[20..0], DATA[15..0], WRITE, READ, SELECT0, SELECT1, SELECT2, SELECT3

### Nets
3V3: SR1.VCC0 SR1.VCC1 SR2.VCC0 SR2.VCC1
GND: SR1.BHE SR1.BLE SR1.CE1 SR1.VSS SR1.VSS1 SR2.BHE SR2.BLE SR2.CE1 SR2.VSS SR2.VSS1
ADDR0: SR1.A0 SR2.A0
ADDR1: SR1.A1 SR2.A1
ADDR2: SR1.A2 SR2.A2
ADDR3: SR1.A3 SR2.A3
ADDR4: SR1.A4 SR2.A4
ADDR5: SR1.A5 SR2.A5
ADDR6: SR1.A6 SR2.A6
ADDR7: SR1.A7 SR2.A7
ADDR8: SR1.A8 SR2.A8
ADDR9: SR1.A9 SR2.A9
ADDR10: SR1.A10 SR2.A10
ADDR11: SR1.A11 SR2.A11
ADDR12: SR1.A12 SR2.A12
ADDR13: SR1.A13 SR2.A13
ADDR14: SR1.A14 SR2.A14
ADDR15: SR1.A15 SR2.A15
ADDR16: SR1.A16 SR2.A16
ADDR17: SR1.A17 SR2.A17
ADDR18: SR1.A18 SR2.A18
ADDR19: SR1.A19 SR2.A19
ADDR20: SR1.A20 SR2.A20
DATA0: SR1.D0 SR2.D0
DATA1: SR1.D1 SR2.D1
DATA2: SR1.D2 SR2.D2
DATA3: SR1.D3 SR2.D3
DATA4: SR1.D4 SR2.D4
DATA5: SR1.D5 SR2.D5
DATA6: SR1.D6 SR2.D6
DATA7: SR1.D7 SR2.D7
DATA8: SR1.D8 SR2.D8
DATA9: SR1.D9 SR2.D9
DATA10: SR1.D10 SR2.D10
DATA11: SR1.D11 SR2.D11
DATA12: SR1.D12 SR2.D12
DATA13: SR1.D13 SR2.D13
DATA14: SR1.D14 SR2.D14
DATA15: SR1.D15 SR2.D15
OE: SR1.OE SR2.OE ; port EBI.READ  [project net EBI.READ]
SEL1: SR1.CE2 ; port EBI.SELECT1  [project net EBI.SELECT1]
SEL2: SR2.CE2 ; port EBI.SELECT2  [project net EBI.SELECT2]
WE: SR1.WE SR2.WE ; port EBI.WRITE  [project net EBI.WRITE]

### Buses and harness runs
bus ADDR[20..0]
bus DATA[15..0]

### Notes on the sheet
- Schematic for SRAM chips
- (in symbol Cypress 16Mbit RAM - CY7C1061DV33) 16Mbit SRAM

### Library data of the parts
SR1 SR2 = Cypress 16Mbit RAM - CY7C1061DV33: pin to pad: A0>A3 A1>A4 A2>A5 A3>B3 A4>B4 A5>C3 A6>C4 A7>D4 A8>H2 A9>H3 A10>H4 A11>H5 A12>G3 A13>G4 A14>F3 A15>F4 A16>E4 A17>D3 A18>H1 A19>H6 A20>G2 BHE>B2 BLE>A1 CE1>B5 CE2>A6 D0>B6 D1>C5 D2>C6 D3>D5 D4>E5 D5>F5 D6>F6 D7>G6 D8>B1 D9>C1 D10>C2 D11>D2 D12>E2 D13>F2 D14>F1 D15>G1 OE>A2 VCC0>E1 VCC1>D6 VSS>D1 VSS1>E6 WE>G5